# EAGLE design Sphagnum_soc_rev_a (EAGLE 9.6.2)
AUTOR: Renato; CODIGO: 0; DESENHO: Renato; EQUIPAMENTO: Alimentador Caes e Gatos; MODELO: JM01; REV: A
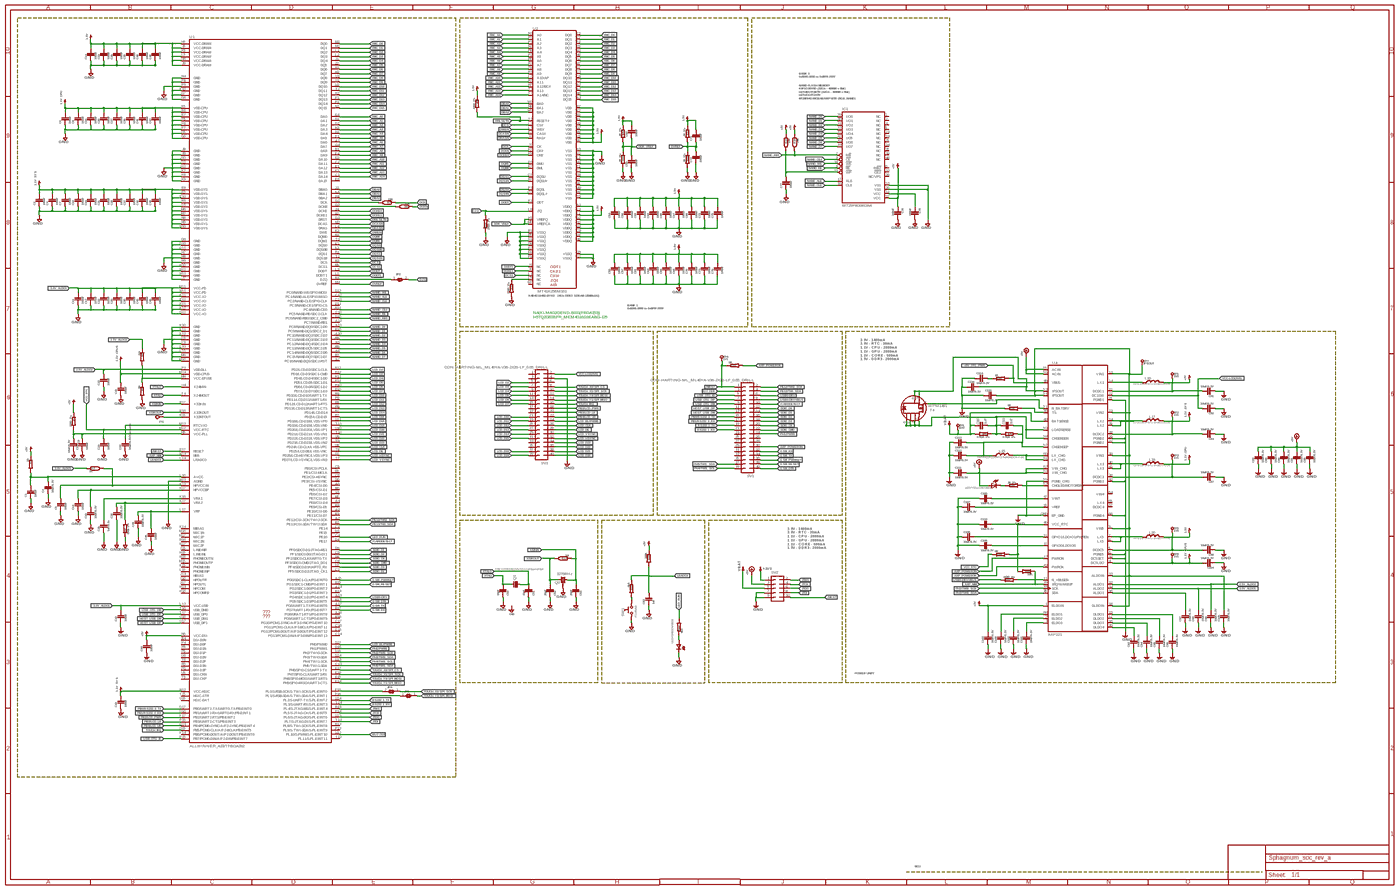
[diagram p0: schematic, sheet 1, overview]
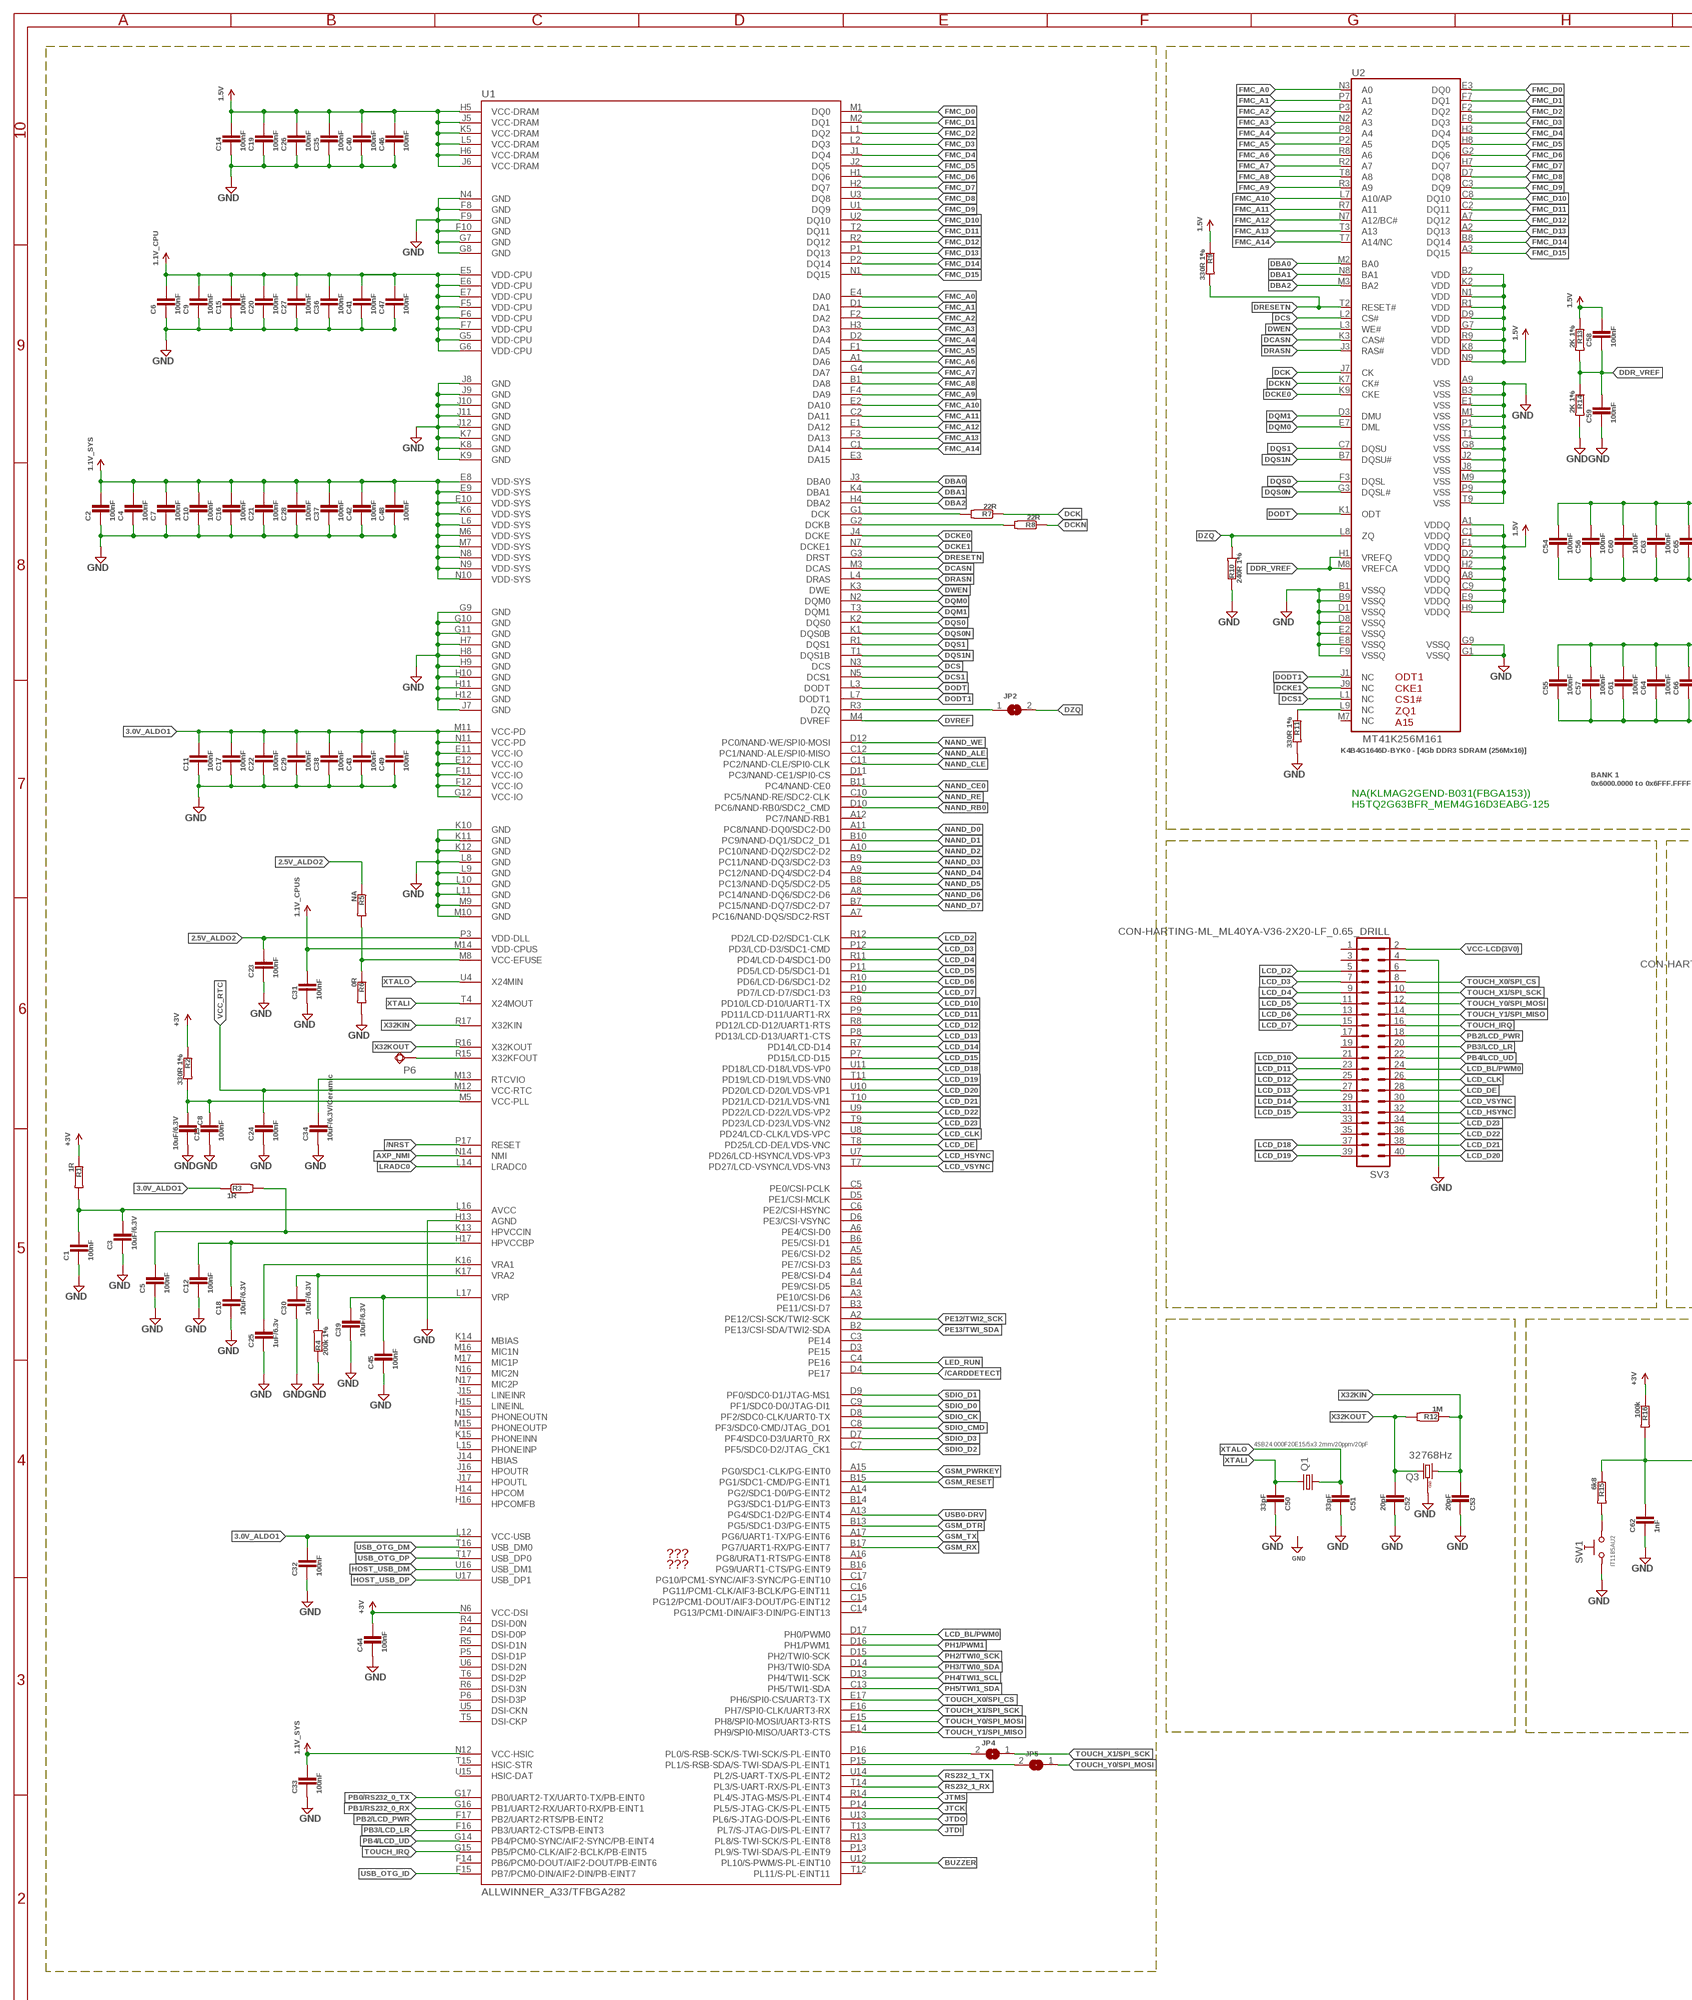
[diagram p1: schematic, sheet 1, part 1 of 4]
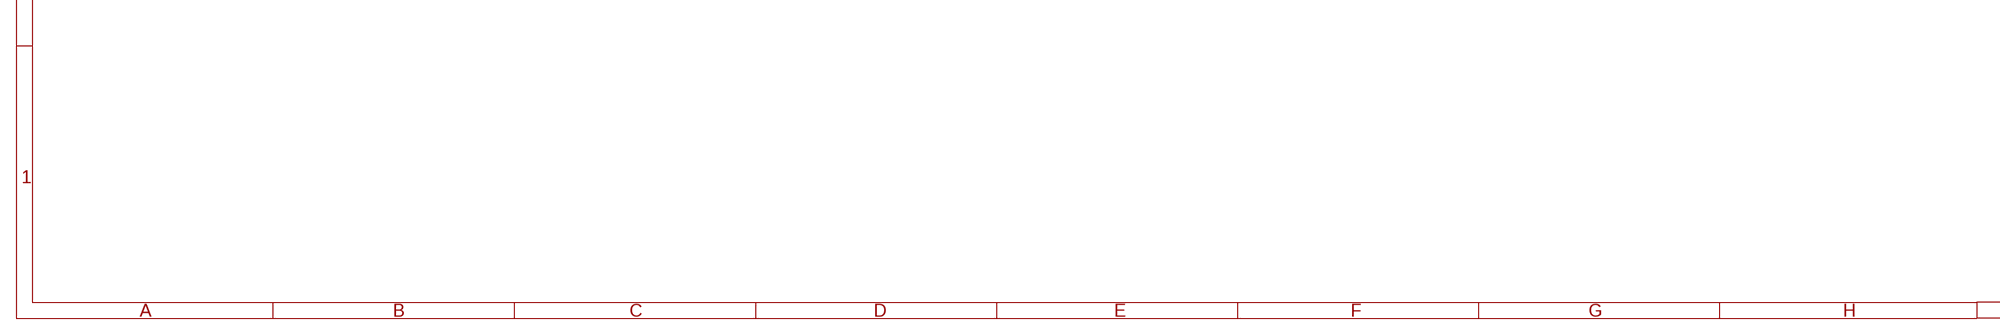
[diagram p2: schematic, sheet 1, part 2 of 4]
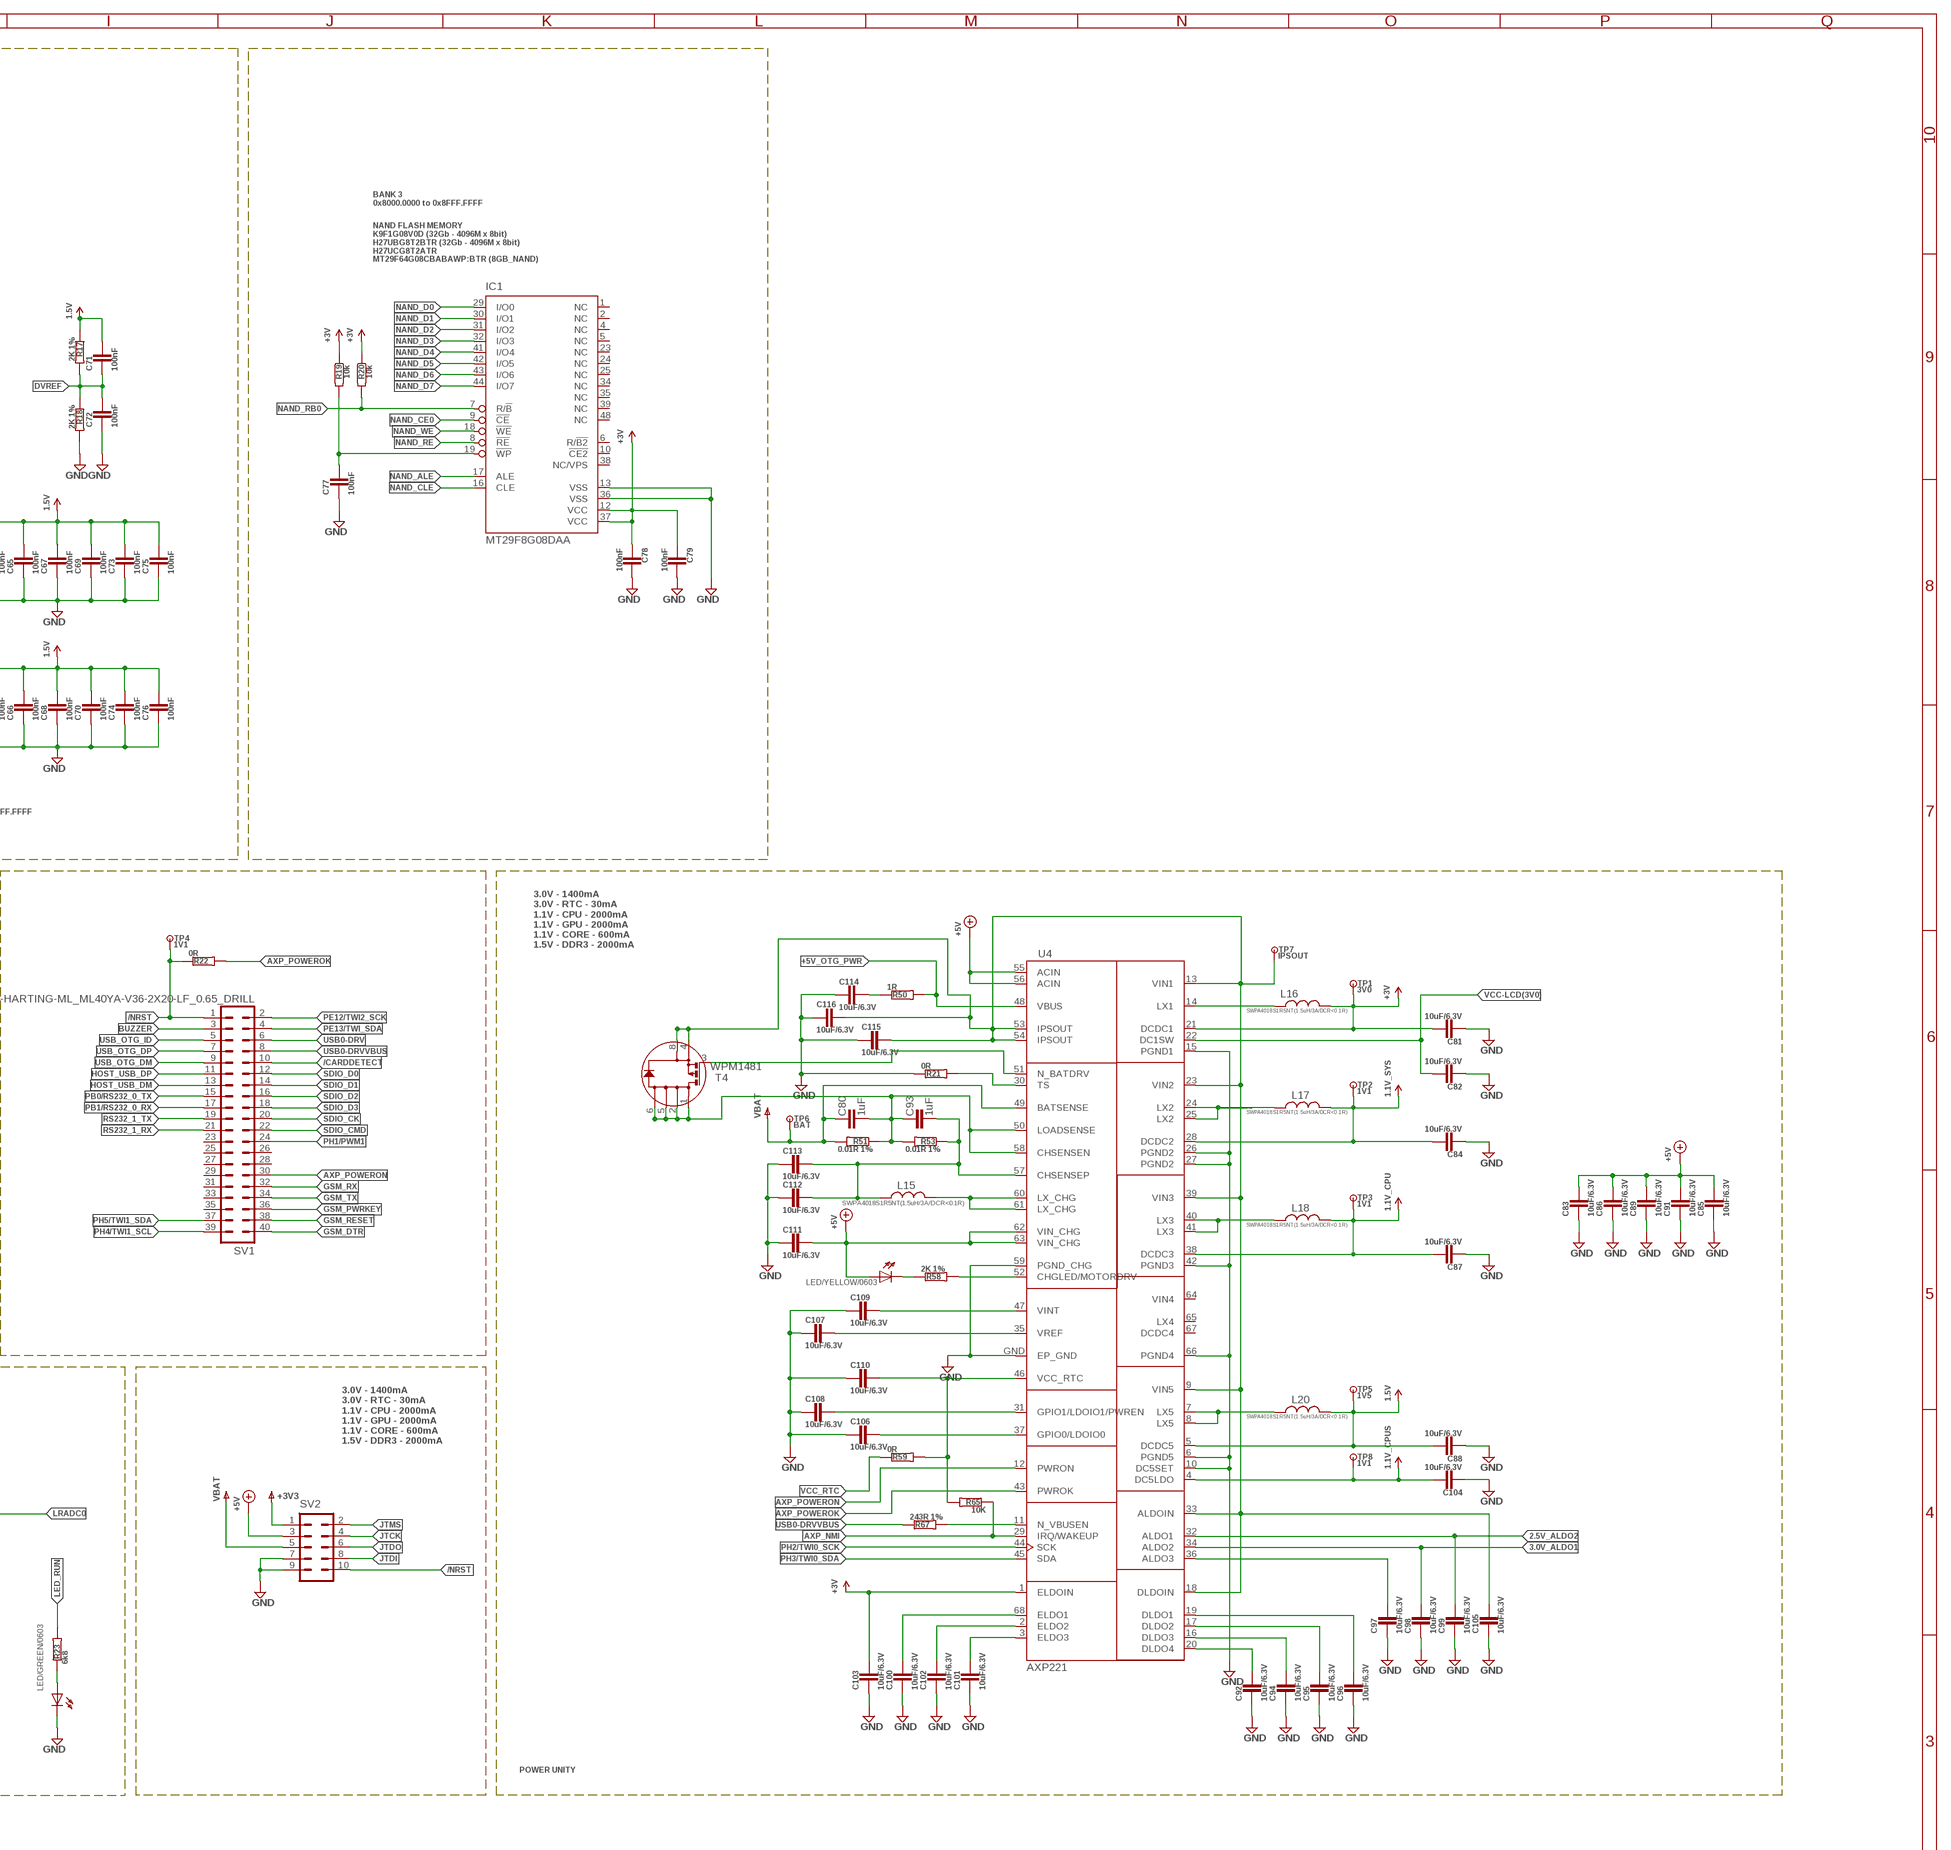
[diagram p3: schematic, sheet 1, part 3 of 4]
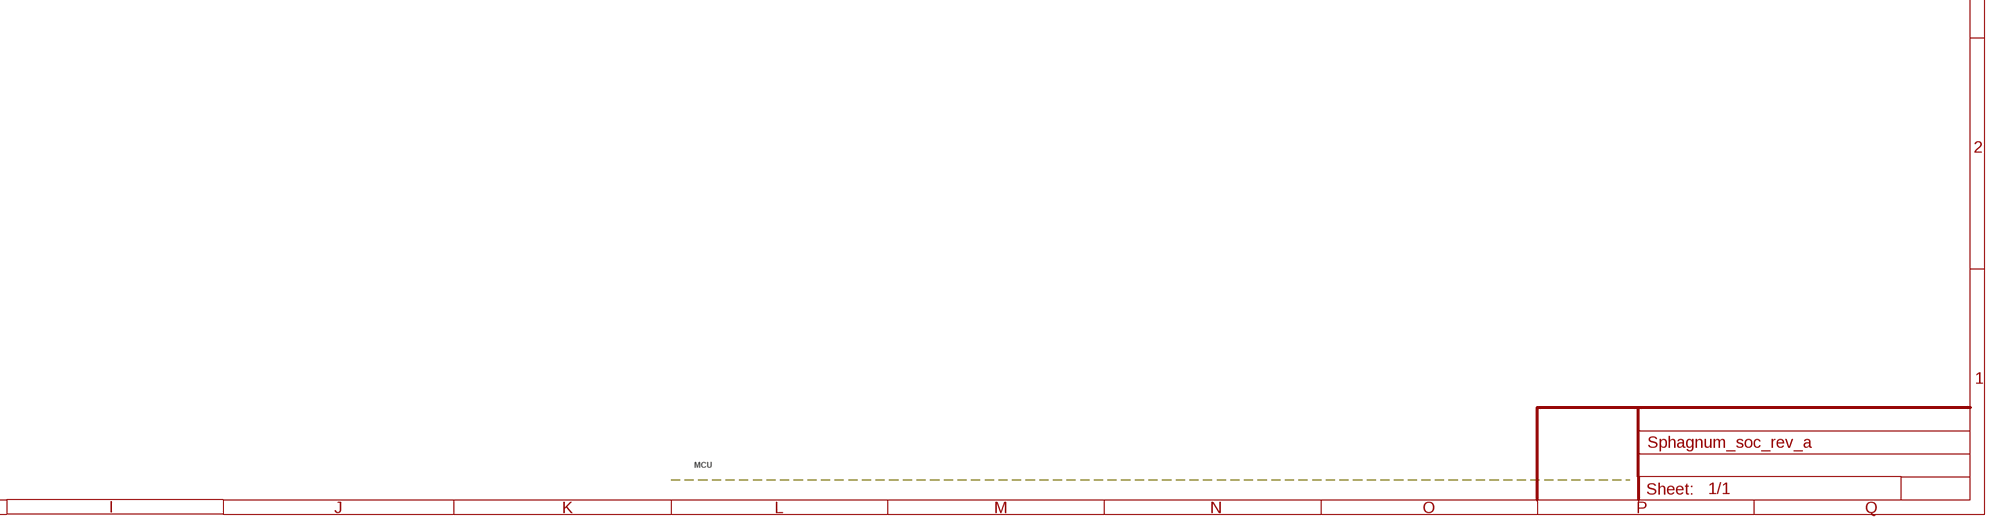
[diagram p4: schematic, sheet 1, part 4 of 4]

## Parts
C1  100nF  C-EUC0603  [C0603]
C2  100nF  C-EUC0603  [C0603]
C3  10uF/6.3V  C-EUC0603  [C0603]
C4  100nF  C-EUC0603  [C0603]
C5  100nF  C-EUC0603  [C0603]
C6  100nF  C-EUC0603  [C0603]
C7  100nF  C-EUC0603  [C0603]
C8  10uF/6.3V  C-EUC0603  [C0603]
C9  100nF  C-EUC0603  [C0603]
C10  100nF  C-EUC0603  [C0603]
C11  100nF  C-EUC0603  [C0603]
C12  100nF  C-EUC0603  [C0603]
C13  100nF  C-EUC0603  [C0603]
C14  100nF  C-EUC0603  [C0603]
C15  100nF  C-EUC0603  [C0603]
C16  100nF  C-EUC0603  [C0603]
C17  100nF  C-EUC0603  [C0603]
C18  10uF/6.3V  C-EUC0603  [C0603]
C19  100nF  C-EUC0603  [C0603]
C20  100nF  C-EUC0603  [C0603]
C21  100nF  C-EUC0603  [C0603]
C22  100nF  C-EUC0603  [C0603]
C23  100nF  C-EUC0603  [C0603]
C24  100nF  C-EUC0603  [C0603]
C25  1uF/6.3v  C-EUC0603  [C0603]
C26  100nF  C-EUC0603  [C0603]
C27  100nF  C-EUC0603  [C0603]
C28  100nF  C-EUC0603  [C0603]
C29  100nF  C-EUC0603  [C0603]
C30  10uF/6.3V  C-EUC0603  [C0603]
C31  100nF  C-EUC0603  [C0603]
C32  100nF  C-EUC0603  [C0603]
C33  100nF  C-EUC0603  [C0603]
C34  10uF/6.3V/Ceramic  C-EUC0603  [C0603]
C35  100nF  C-EUC0603  [C0603]
C36  100nF  C-EUC0603  [C0603]
C37  100nF  C-EUC0603  [C0603]
C38  100nF  C-EUC0603  [C0603]
C39  10uF/6.3V  C-EUC0603  [C0603]
C40  100nF  C-EUC0603  [C0603]
C41  100nF  C-EUC0603  [C0603]
C42  100nF  C-EUC0603  [C0603]
C43  100nF  C-EUC0603  [C0603]
C44  100nF  C-EUC0603  [C0603]
C45  100nF  C-EUC0603  [C0603]
C46  100nF  C-EUC0603  [C0603]
C47  100nF  C-EUC0603  [C0603]
C48  100nF  C-EUC0603  [C0603]
C49  100nF  C-EUC0603  [C0603]
C50  33pF  C-EUC0603  [C0603]
C51  33pF  C-EUC0603  [C0603]
C52  20pF  C-EUC0603  [C0603]
C53  20pF  C-EUC0603  [C0603]
C54  100nF  C-EUC0603  [C0603]
C55  100nF  C-EUC0603  [C0603]
C56  100nF  C-EUC0603  [C0603]
C57  100nF  C-EUC0603  [C0603]
C58  100nF  C-EUC0603  [C0603]
C59  100nF  C-EUC0603  [C0603]
C60  100nF  C-EUC0603  [C0603]
C61  100nF  C-EUC0603  [C0603]
C62  1nF  C-EUC0603  [C0603]
C63  100nF  C-EUC0603  [C0603]
C64  100nF  C-EUC0603  [C0603]
C65  100nF  C-EUC0603  [C0603]
C66  100nF  C-EUC0603  [C0603]
C67  100nF  C-EUC0603  [C0603]
C68  100nF  C-EUC0603  [C0603]
C69  100nF  C-EUC0603  [C0603]
C70  100nF  C-EUC0603  [C0603]
C71  100nF  C-EUC0603  [C0603]
C72  100nF  C-EUC0603  [C0603]
C73  100nF  C-EUC0603  [C0603]
C74  100nF  C-EUC0603  [C0603]
C75  100nF  C-EUC0603  [C0603]
C76  100nF  C-EUC0603  [C0603]
C77  100nF  C-EUC0603  [C0603]
C78  100nF  C-EUC0603  [C0603]
C79  100nF  C-EUC0603  [C0603]
C80  1uF  C-EUC0603  [C0603]
C81  10uF/6.3V  C-EUC0603  [C0603]
C82  10uF/6.3V  C-EUC0603  [C0603]
C83  10uF/6.3V  C-EUC0603  [C0603]
C84  10uF/6.3V  C-EUC0603  [C0603]
C85  10uF/6.3V  C-EUC0603  [C0603]
C86  10uF/6.3V  C-EUC0603  [C0603]
C87  10uF/6.3V  C-EUC0603  [C0603]
C88  10uF/6.3V  C-EUC0603  [C0603]
C89  10uF/6.3V  C-EUC0603  [C0603]
C91  10uF/6.3V  C-EUC0603  [C0603]
C92  10uF/6.3V  C-EUC0603  [C0603]
C93  1uF  C-EUC0603  [C0603]
C94  10uF/6.3V  C-EUC0603  [C0603]
C95  10uF/6.3V  C-EUC0603  [C0603]
C96  10uF/6.3V  C-EUC0603  [C0603]
C97  10uF/6.3V  C-EUC0603  [C0603]
C98  10uF/6.3V  C-EUC0603  [C0603]
C99  10uF/6.3V  C-EUC0603  [C0603]
C100  10uF/6.3V  C-EUC0603  [C0603]
C101  10uF/6.3V  C-EUC0603  [C0603]
C102  10uF/6.3V  C-EUC0603  [C0603]
C103  10uF/6.3V  C-EUC0603  [C0603]
C104  10uF/6.3V  C-EUC0603  [C0603]
C105  10uF/6.3V  C-EUC0603  [C0603]
C106  10uF/6.3V  C-EUC0603  [C0603]
C107  10uF/6.3V  C-EUC0603  [C0603]
C108  10uF/6.3V  C-EUC0603  [C0603]
C109  10uF/6.3V  C-EUC0603  [C0603]
C110  10uF/6.3V  C-EUC0603  [C0603]
C111  10uF/6.3V  C-EUC0603  [C0603]
C112  10uF/6.3V  C-EUC0603  [C0603]
C113  10uF/6.3V  C-EUC0603  [C0603]
C114  10uF/6.3V  C-EUC0603  [C0603]
C115  10uF/6.3V  C-EUC0603  [C0603]
C116  10uF/6.3V  C-EUC0603  [C0603]
CHGLED  LED/YELLOW/0603  LEDLED-0603_TEST  [LED-0603_TEST]
IC1  MT29F8G08DAA  [TSOP48]
JP2  JUMPER-2SMD-NO  [SJ_2S-NO]
JP4  JUMPER_2_NO  [JUMPER_2_NO]
JP5  JUMPER_2_NO  [JUMPER_2_NO]
L15  SWPA4018S1R5NT(1.5uH/3A/DCR<0.1R)  L-SWPA4018S  [SWPA4018S]
L16  SWPA4018S1R5NT(1.5uH/3A/DCR<0.1R)  L-SWPA4018S  [SWPA4018S]
L17  SWPA4018S1R5NT(1.5uH/3A/DCR<0.1R)  L-SWPA4018S  [SWPA4018S]
L18  SWPA4018S1R5NT(1.5uH/3A/DCR<0.1R)  L-SWPA4018S  [SWPA4018S]
L20  SWPA4018S1R5NT(1.5uH/3A/DCR<0.1R)  L-SWPA4018S  [SWPA4018S]
P6  TESTPADTESTPAD_40-ROUND  [TESTPAD_40-ROUND]
Q1  4SB24.000F20E15/5x3.2mm/20ppm/20pF  HC49/S_E4SB25.000F20E15  [HCX-4S]
Q3  32768Hz  Q_GND  [TC26H_3_REPAIR]
R1  1R  R-EU_R0603  [R0603]
R2  330R 1%  R-EU_R0603  [R0603]
R3  1R  R-EU_R0603  [R0603]
R4  200k 1%  R-EU_R0603  [R0603]
R5  NA  R-EU_R0603  [R0603]
R6  0R  R-EU_R0603  [R0603]
R7  22R  R-EU_R0603  [R0603]
R8  22R  R-EU_R0603  [R0603]
R9  330R 1%  R-EU_R0603  [R0603]
R10  240R 1%  R-EU_R0603  [R0603]
R11  330R 1%  R-EU_R0603  [R0603]
R12  1M  R-EU_R0603  [R0603]
R13  2K 1%  R-EU_R0603  [R0603]
R14  2K 1%  R-EU_R0603  [R0603]
R15  6k8  R-EU_R0603  [R0603]
R16  100k  R-EU_R0603  [R0603]
R17  2K 1%  R-EU_R0603  [R0603]
R18  2K 1%  R-EU_R0603  [R0603]
R19  10k  R-EU_R0603  [R0603]
R20  10k  R-EU_R0603  [R0603]
R21  0R  R-EU_R0603  [R0603]
R22  0R  R-EU_R0603  [R0603]
R23  6k8  R-EU_R0603  [R0603]
R50  1R  R-EU_R0603  [R0603]
R51  0.01R 1%  R-EU_R0603  [R0603]
R53  0.01R 1%  R-EU_R0603  [R0603]
R58  2K 1%  R-EU_R0603  [R0603]
R59  0R  R-EU_R0603  [R0603]
R65  10K  R-EU_R0603  [R0603]
R67  243R 1%  R-EU_R0603  [R0603]
RUN  LED/GREEN/0603  LEDLED-0603_TEST  [LED-0603_TEST]
SV1  CON-HARTING-ML_ML40YA-V36-2X20-LF_0.65_DRILL  [CON-HARTING-ML_YA-V36P-2X20-LF_0.65_DRILL]
SV2  CON-HARTING-ML_ML10YA-V36P-2X5-LF_0.60_DRILL  [CON-HARTING-ML_YA-V36P-2X5-LF_0.60_DRILL]
SV3  CON-HARTING-ML_ML40YA-V36-2X20-LF_0.65_DRILL  [CON-HARTING-ML_YA-V36P-2X20-LF_0.65_DRILL]
SW1  IT1185AU2  SW-TAKTIT1185AU2  [IT1185AU2]
T4  WPM1481  [DFN2*2-6L]
TP1  3V0  TEST-POINT3  [PAD.03X.03]
TP2  1V1  TEST-POINT3  [PAD.03X.03]
TP3  1V1  TEST-POINT3  [PAD.03X.03]
TP4  1V1  TEST-POINT3  [PAD.03X.03]
TP5  1V5  TEST-POINT3  [PAD.03X.03]
TP6  BAT  TEST-POINT3  [PAD.03X.03]
TP7  IPSOUT  TEST-POINT3  [PAD.03X.03]
TP8  1V1  TEST-POINT3  [PAD.03X.03]
U1  ALLWINNER_A33/TFBGA282  [TFBGA282]
U2  MT41K256M161  [FBGA_96BALL]
U4  AXP221  [OLIMEX_IC_QFN68-8X8-04]

## Nets
1.1V_CPU [pwr]: C6.1 C9.1 C15.1 C20.1 C27.1 C36.1 C41.1 C47.1 C87.1 L18.1 TP3.P$1 U1.E5(VDD-CPU) U1.E6(VDD-CPU) U1.E7(VDD-CPU) U1.F5(VDD-CPU) U1.F6(VDD-CPU) U1.F7(VDD-CPU) U1.G5(VDD-CPU) U1.G6(VDD-CPU) U4.38(DCDC3)
1.1V_CPUS: C31.1 C104.1 TP8.P$1 U1.M14(VDD-CPUS) U4.4(DC5LDO)
1.1V_SYS [pwr]: C2.1 C4.1 C7.1 C10.1 C16.1 C21.1 C28.1 C33.1 C37.1 C42.1 C48.1 C84.1 L17.1 TP2.P$1 U1.E8(VDD-SYS) U1.E9(VDD-SYS) U1.E10(VDD-SYS) U1.K6(VDD-SYS) U1.L6(VDD-SYS) U1.M6(VDD-SYS) U1.M7(VDD-SYS) U1.N8(VDD-SYS) U1.N9(VDD-SYS) U1.N10(VDD-SYS) U1.N12(VCC-HSIC) U4.28(DCDC2)
1.5V [pwr]: C14.1 C19.1 C26.1 C35.1 C40.1 C46.1 C54.1 C55.1 C56.1 C57.1 C58.1 C60.1 C61.1 C63.1 C64.1 C65.1 C66.1 C67.1 C68.1 C69.1 C70.1 C71.1 C73.1 C74.1 C75.1 C76.1 C88.1 L20.1 R9.1 R13.1 R17.1 TP5.P$1 U1.H5(VCC-DRAM) U1.H6(VCC-DRAM) U1.J5(VCC-DRAM) U1.J6(VCC-DRAM) U1.K5(VCC-DRAM) U1.L5(VCC-DRAM) U2.A1(VDDQ) U2.A8(VDDQ) U2.B2(VDD) U2.C1(VDDQ) U2.C9(VDDQ) U2.D2(VDDQ) U2.D9(VDD) U2.E9(VDDQ) U2.F1(VDDQ) U2.G7(VDD) U2.H2(VDDQ) U2.H9(VDDQ) U2.K2(VDD) U2.K8(VDD) U2.N1(VDD) U2.N9(VDD) U2.R1(VDD) U2.R9(VDD) U4.5(DCDC5)
2.5V_ALDO2: C23.1 C99.1 R5.1 U1.P3(VDD-DLL) U4.32(ALDO1)
3.0V_ALDO1: C11.1 C17.1 C22.1 C29.1 C32.1 C38.1 C43.1 C49.1 C98.1 R3.1 U1.E11(VCC-IO) U1.E12(VCC-IO) U1.F11(VCC-IO) U1.F12(VCC-IO) U1.G12(VCC-IO) U1.L12(VCC-USB) U1.M11(VCC-PD) U1.N11(VCC-PD) U4.34(ALDO2)
+3V [pwr]: C44.1 C78.2 C79.2 C81.1 C103.1 IC1.12(VCC) IC1.37(VCC) L16.1 R1.1 R2.1 R16.1 R19.1 R20.1 TP1.P$1 U1.N6(VCC-DSI) U4.1(ELDOIN) U4.21(DCDC1)
+3V3 [pwr]: C80.2 R51.2 SV2.1 SV2.5 TP6.P$1 U4.49(BATSENSE) ; supply symbol labelled VBAT
+5V [pwr]: C83.1 C85.1 C86.1 C89.1 C91.1 C111.1 CHGLED.A SV2.3 U4.55(ACIN) U4.56(ACIN) U4.62(VIN_CHG) U4.63(VIN_CHG)
+5V_OTG_PWR: R50.2 U4.48(VBUS)
/CARDDETECT: SV1.10 U1.D4(PE17)
/NRST: R22.1 SV1.1 SV2.10 TP4.P$1 U1.P17(RESET)
AXP_NMI: R65.1 U1.N14(NMI) U4.29(IRQ/WAKEUP)
AXP_POWEROK: R22.2 U4.43(PWROK)
AXP_POWERON: SV1.30 U4.12(PWRON)
BUZZER: SV1.3 U1.U12(PL10/S-PWM/S-PL-EINT10)
DBA0 [memory]: U1.J3(DBA0) U2.M2(BA0)
DBA1 [memory]: U1.K4(DBA1) U2.N8(BA1)
DBA2 [memory]: U1.H4(DBA2) U2.M3(BA2)
DCASN [memory]: U1.M3(DCAS) U2.K3(CAS#)
DCK [memory]: R7.1 U2.J7(CK)
DCKE0 [memory]: U1.J4(DCKE) U2.K9(CKE)
DCKE1 [memory]: U1.N7(DCKE1) U2.J9(NC)
DCKN [memory]: R8.1 U2.K7(CK#)
DCS [memory]: U1.N3(DCS) U2.L2(CS#)
DCS1 [memory]: U1.N5(DCS1) U2.L1(NC)
DDR_VREF [memory]: C58.2 C59.1 R13.2 R14.1 U2.H1(VREFQ) U2.M8(VREFCA)
DODT [memory]: U1.L3(DODT) U2.K1(ODT)
DODT1 [memory]: U1.L7(DODT1) U2.J1(NC)
DQM0 [memory]: U1.N2(DQM0) U2.E7(DML)
DQM1 [memory]: U1.T3(DQM1) U2.D3(DMU)
DQS0 [memory]: U1.K2(DQS0) U2.F3(DQSL)
DQS0N [memory]: U1.K1(DQS0B) U2.G3(DQSL#)
DQS1 [memory]: U1.R1(DQS1) U2.C7(DQSU)
DQS1N [memory]: U1.T1(DQS1B) U2.B7(DQSU#)
DRASN [memory]: U1.L4(DRAS) U2.J3(RAS#)
DRESETN [memory]: R9.2 U1.G3(DRST) U2.T2(RESET#)
DVREF [memory]: C71.2 C72.1 R17.2 R18.1 U1.M4(DVREF)
DWEN [memory]: U1.K3(DWE) U2.L3(WE#)
DZQ [memory]: JP2.2 R10.2 U2.L8(ZQ)
FMC_A0 [memory]: U1.E4(DA0) U2.N3(A0)
FMC_A1 [memory]: U1.D1(DA1) U2.P7(A1)
FMC_A2 [memory]: U1.F2(DA2) U2.P3(A2)
FMC_A3 [memory]: U1.H3(DA3) U2.N2(A3)
FMC_A4 [memory]: U1.D2(DA4) U2.P8(A4)
FMC_A5 [memory]: U1.F1(DA5) U2.P2(A5)
FMC_A6 [memory]: U1.A1(DA6) U2.R8(A6)
FMC_A7 [memory]: U1.G4(DA7) U2.R2(A7)
FMC_A8 [memory]: U1.B1(DA8) U2.T8(A8)
FMC_A9 [memory]: U1.F4(DA9) U2.R3(A9)
FMC_A10 [memory]: U1.E2(DA10) U2.L7(A10/AP)
FMC_A11 [memory]: U1.C2(DA11) U2.R7(A11)
FMC_A12 [memory]: U1.E1(DA12) U2.N7(A12/BC#)
FMC_A13 [memory]: U1.F3(DA13) U2.T3(A13)
FMC_A14 [memory]: U1.C1(DA14) U2.T7(A14/NC)
FMC_D0 [memory]: U1.M1(DQ0) U2.E3(DQ0)
FMC_D1 [memory]: U1.M2(DQ1) U2.F7(DQ1)
FMC_D2 [memory]: U1.L1(DQ2) U2.F2(DQ2)
FMC_D3 [memory]: U1.L2(DQ3) U2.F8(DQ3)
FMC_D4 [memory]: U1.J1(DQ4) U2.H3(DQ4)
FMC_D5 [memory]: U1.J2(DQ5) U2.H8(DQ5)
FMC_D6 [memory]: U1.H1(DQ6) U2.G2(DQ6)
FMC_D7 [memory]: U1.H2(DQ7) U2.H7(DQ7)
FMC_D8 [memory]: U1.U3(DQ8) U2.D7(DQ8)
FMC_D9 [memory]: U1.U1(DQ9) U2.C3(DQ9)
FMC_D10 [memory]: U1.U2(DQ10) U2.C8(DQ10)
FMC_D11 [memory]: U1.T2(DQ11) U2.C2(DQ11)
FMC_D12 [memory]: U1.R2(DQ12) U2.A7(DQ12)
FMC_D13 [memory]: U1.P1(DQ13) U2.A2(DQ13)
FMC_D14 [memory]: U1.P2(DQ14) U2.B8(DQ14)
FMC_D15 [memory]: U1.N1(DQ15) U2.A3(DQ15)
GND: C1.2 C2.2 C3.2 C4.2 C5.2 C6.2 C7.2 C8.1 C9.2 C10.2 C11.2 C12.2 C13.2 C14.2 C15.2 C16.2 C17.2 C18.2 C19.2 C20.2 C21.2 C22.2 C23.2 C24.2 C25.2 C26.2 C27.2 C28.2 C29.2 C30.2 C31.2 C32.2 C33.2 C34.2 C35.2 C36.2 C37.2 C38.2 C39.2 C40.2 C41.2 C42.2 C43.2 C44.2 C45.2 C46.2 C47.2 C48.2 C49.2 C50.2 C51.2 C52.2 C53.2 C54.2 C55.2 C56.2 C57.2 C59.2 C60.2 C61.2 C62.2 C63.2 C64.2 C65.2 C66.2 C67.2 C68.2 C69.2 C70.2 C72.2 C73.2 C74.2 C75.2 C76.2 C77.2 C78.1 C79.1 C81.2 C82.2 C83.2 C84.2 C85.2 C86.2 C87.2 C88.2 C89.2 C91.2 C92.2 C94.2 C95.2 C96.2 C97.2 C98.2 C99.2 C100.2 C101.2 C102.2 C103.2 C104.2 C105.2 C106.2 C107.2 C108.2 C109.2 C110.2 C111.2 C112.2 C113.2 C114.2 C115.2 C116.2 IC1.13(VSS) IC1.36(VSS) Q3.GND R4.1 R6.2 R10.1 R11.2 R14.2 R18.2 R21.1 RUN.C SV2.7 SV2.9 SV3.4 SW1.1 U1.F8(GND) U1.F9(GND) U1.F10(GND) U1.G7(GND) U1.G8(GND) U1.G9(GND) U1.G10(GND) U1.G11(GND) U1.H7(GND) U1.H8(GND) U1.H9(GND) U1.H10(GND) U1.H11(GND) U1.H12(GND) U1.H13(AGND) U1.J7(GND) U1.J8(GND) U1.J9(GND) U1.J10(GND) U1.J11(GND) U1.J12(GND) U1.K7(GND) U1.K8(GND) U1.K9(GND) U1.K10(GND) U1.K11(GND) U1.K12(GND) U1.L8(GND) U1.L9(GND) U1.L10(GND) U1.L11(GND) U1.M9(GND) U1.M10(GND) U1.N4(GND) U2.A9(VSS) U2.B1(VSSQ) U2.B3(VSS) U2.B9(VSSQ) U2.D1(VSSQ) U2.D8(VSSQ) U2.E1(VSS) U2.E2(VSSQ) U2.E8(VSSQ) U2.F9(VSSQ) U2.G1(VSSQ) U2.G8(VSS) U2.G9(VSSQ) U2.J2(VSS) U2.J8(VSS) U2.M1(VSS) U2.M9(VSS) U2.P1(VSS) U2.P9(VSS) U2.T1(VSS) U2.T9(VSS) U4.6(PGND5) U4.10(DC5SET) U4.15(PGND1) U4.26(PGND2) U4.27(PGND2) U4.42(PGND3) U4.59(PGND_CHG) U4.66(PGND4) U4.GND(EP_GND)
GSM_DTR: SV1.40 U1.B13(PG5/SDC1-D3/PG-EINT5)
GSM_PWRKEY: SV1.36 U1.A15(PG0/SDC1-CLK/PG-EINT0)
GSM_RESET: SV1.38 U1.B15(PG1/SDC1-CMD/PG-EINT1)
GSM_RX: SV1.32 U1.B17(PG7/UART1-RX/PG-EINT7)
GSM_TX: SV1.34 U1.A17(PG6/UART1-TX/PG-EINT6)
HOST_USB_DM: SV1.13 U1.U16(USB_DM1)
HOST_USB_DP: SV1.11 U1.U17(USB_DP1)
HPVCCIN: C5.1 R3.2 U1.K13(HPVCCIN)
JTCK: SV2.4 U1.P14(PL5/S-JTAG-CK/S-PL-EINT5)
JTDI: SV2.8 U1.T13(PL7/S-JTAG-DI/S-PL-EINT7)
JTDO: SV2.6 U1.U13(PL6/S-JTAG-DO/S-PL-EINT6)
JTMS: SV2.2 U1.R14(PL4/S-JTAG-MS/S-PL-EINT4)
LCD_BL/PWM0 [lcd]: SV3.24 U1.D17(PH0/PWM0)
LCD_CLK [lcd]: SV3.26 U1.U8(PD24/LCD-CLK/LVDS-VPC)
LCD_D2 [lcd]: SV3.5 U1.R12(PD2/LCD-D2/SDC1-CLK)
LCD_D3 [lcd]: SV3.7 U1.P12(PD3/LCD-D3/SDC1-CMD)
LCD_D4 [lcd]: SV3.9 U1.R11(PD4/LCD-D4/SDC1-D0)
LCD_D5 [lcd]: SV3.11 U1.P11(PD5/LCD-D5/SDC1-D1)
LCD_D6 [lcd]: SV3.13 U1.R10(PD6/LCD-D6/SDC1-D2)
LCD_D7 [lcd]: SV3.15 U1.P10(PD7/LCD-D7/SDC1-D3)
LCD_D10 [lcd]: SV3.21 U1.R9(PD10/LCD-D10/UART1-TX)
LCD_D11 [lcd]: SV3.23 U1.P9(PD11/LCD-D11/UART1-RX)
LCD_D12 [lcd]: SV3.25 U1.R8(PD12/LCD-D12/UART1-RTS)
LCD_D13 [lcd]: SV3.27 U1.P8(PD13/LCD-D13/UART1-CTS)
LCD_D14 [lcd]: SV3.29 U1.R7(PD14/LCD-D14)
LCD_D15 [lcd]: SV3.31 U1.P7(PD15/LCD-D15)
LCD_D18 [lcd]: SV3.37 U1.U11(PD18/LCD-D18/LVDS-VP0)
LCD_D19 [lcd]: SV3.39 U1.T11(PD19/LCD-D19/LVDS-VN0)
LCD_D20 [lcd]: SV3.40 U1.U10(PD20/LCD-D20/LVDS-VP1)
LCD_D21 [lcd]: SV3.38 U1.T10(PD21/LCD-D21/LVDS-VN1)
LCD_D22 [lcd]: SV3.36 U1.U9(PD22/LCD-D22/LVDS-VP2)
LCD_D23 [lcd]: SV3.34 U1.T9(PD23/LCD-D23/LVDS-VN2)
LCD_DE [lcd]: SV3.28 U1.T8(PD25/LCD-DE/LVDS-VNC)
LCD_HSYNC [lcd]: SV3.32 U1.U7(PD26/LCD-HSYNC/LVDS-VP3)
LCD_VSYNC [lcd]: SV3.30 U1.T7(PD27/LCD-VSYNC/LVDS-VN3)
LED_RUN: R23.2 U1.C4(PE16)
LRADC0: C62.1 R15.1 R16.2 U1.L14(LRADC0)
N$1: JP2.1 U1.R3(DZQ)
N$2 [pwr]: R5.2 R6.1 U1.M8(VCC-EFUSE)
N$3: JP5.2 U1.P15(PL1/S-RSB-SDA/S-TWI-SDA/S-PL-EINT1)
N$4: R11.1 U2.L9(NC)
N$5: C77.1 IC1.19(!WP) R19.2
N$6: C34.1 U1.M13(RTCVIO)
N$7: JP4.2 U1.P16(PL0/S-RSB-SCK/S-TWI-SCK/S-PL-EINT0)
N$8: C8.2 C13.1 R2.2 U1.M5(VCC-PLL)
N$9: T4.3(G) U4.51(N_BATDRV)
N$10: C80.1 C93.2 R51.1 R53.2 T4.1(D) T4.2(D1) T4.5(D2) T4.6(D3) T4.7(D4) U4.50(LOADSENSE) U4.58(CHSENSEN)
N$11: R7.2 U1.G1(DCK)
N$12: R8.2 U1.G2(DCKB)
N$13: R23.1 RUN.A
N$14: C105.1 C115.1 C116.1 T4.4(S) T4.8(S1) TP7.P$1 U4.9(VIN5) U4.13(VIN1) U4.18(DLDOIN) U4.23(VIN2) U4.33(ALDOIN) U4.39(VIN3) U4.53(IPSOUT) U4.54(IPSOUT)
N$19: C12.1 C18.1 U1.H17(HPVCCBP)
N$28: C25.1 U1.K16(VRA1)
N$31 [pwr]: C1.1 C3.1 R1.2 U1.L16(AVCC)
N$39: R15.2 SW1.2
N$52: P6.1(PP) U1.R15(X32KFOUT)
N$66: L15.1 U4.60(LX_CHG) U4.61(LX_CHG)
N$67: CHGLED.C R58.1
N$71: C93.1 C112.1 C113.1 L15.2 R53.1 U4.57(CHSENSEP)
N$73: C106.1 U4.37(GPIO0/LDOIO0)
N$74: C108.1 U4.31(GPIO1/LDOIO1/PWREN)
N$75: C92.1 U4.20(DLDO4)
N$76: C94.1 U4.16(DLDO3)
N$79: L16.2 U4.14(LX1)
N$80: L17.2 U4.24(LX2) U4.25(LX2)
N$82: L18.2 U4.40(LX3) U4.41(LX3)
N$86: L20.2 U4.7(LX5) U4.8(LX5)
N$87: R67.2 U4.11(N_VBUSEN)
N$88 [pwr]: R21.2 U4.30(TS)
N$89: C95.1 U4.17(DLDO2)
N$93: C96.1 U4.19(DLDO1)
N$95: C97.1 U4.36(ALDO3)
N$96: C101.1 U4.3(ELDO3)
N$97: C102.1 U4.2(ELDO2)
N$98: C100.1 U4.68(ELDO1)
N$105: C110.1 R59.2 R65.2 U4.46(VCC_RTC)
N$107: C107.1 U4.35(VREF)
N$108: C109.1 U4.47(VINT)
N$109: R58.2 U4.52(CHGLED/MOTORDRV)
N$122: C39.1 C45.1 U1.L17(VRP)
N$135: C114.1 R50.1
N$176: C30.1 R4.2 U1.K17(VRA2)
NAND_ALE [memory]: IC1.17(ALE) U1.C12(PC1/NAND-ALE/SPI0-MISO)
NAND_CE0 [memory]: IC1.9(!CE) U1.B11(PC4/NAND-CE0)
NAND_CLE [memory]: IC1.16(CLE) U1.C11(PC2/NAND-CLE/SPI0-CLK)
NAND_D0 [memory]: IC1.29(I/O0) U1.A11(PC8/NAND-DQ0/SDC2-D0)
NAND_D1 [memory]: IC1.30(I/O1) U1.B10(PC9/NAND-DQ1/SDC2_D1)
NAND_D2 [memory]: IC1.31(I/O2) U1.A10(PC10/NAND-DQ2/SDC2-D2)
NAND_D3 [memory]: IC1.32(I/O3) U1.B9(PC11/NAND-DQ3/SDC2-D3)
NAND_D4 [memory]: IC1.41(I/O4) U1.A9(PC12/NAND-DQ4/SDC2-D4)
NAND_D5 [memory]: IC1.42(I/O5) U1.B8(PC13/NAND-DQ5/SDC2-D5)
NAND_D6 [memory]: IC1.43(I/O6) U1.A8(PC14/NAND-DQ6/SDC2-D6)
NAND_D7 [memory]: IC1.44(I/O7) U1.B7(PC15/NAND-DQ7/SDC2-D7)
NAND_RB0 [memory]: IC1.7(R/!B) R20.2 U1.D10(PC6/NAND-RB0/SDC2_CMD)
NAND_RE [memory]: IC1.8(!RE) U1.C10(PC5/NAND-RE/SDC2-CLK)
NAND_WE [memory]: IC1.18(!WE) U1.D12(PC0/NAND-WE/SPI0-MOSI)
PB0/RS232_0_TX: SV1.15 U1.G17(PB0/UART2-TX/UART0-TX/PB-EINT0)
PB1/RS232_0_RX: SV1.17 U1.G16(PB1/UART2-RX/UART0-RX/PB-EINT1)
PB2/LCD_PWR [lcd]: SV3.18 U1.F17(PB2/UART2-RTS/PB-EINT2)
PB3/LCD_LR [lcd]: SV3.20 U1.F16(PB3/UART2-CTS/PB-EINT3)
PB4/LCD_UD [lcd]: SV3.22 U1.G14(PB4/PCM0-SYNC/AIF2-SYNC/PB-EINT4)
PE12/TWI2_SCK: SV1.2 U1.A2(PE12/CSI-SCK/TWI2-SCK)
PE13/TWI_SDA: SV1.4 U1.B2(PE13/CSI-SDA/TWI2-SDA)
PH1/PWM1: SV1.24 U1.D16(PH1/PWM1)
PH2/TWI0_SCK: U1.D15(PH2/TWI0-SCK) U4.44(SCK)
PH3/TWI0_SDA: U1.D14(PH3/TWI0-SDA) U4.45(SDA)
PH4/TWI1_SCL: SV1.39 U1.D13(PH4/TWI1-SCK)
PH5/TWI1_SDA: SV1.37 U1.C13(PH5/TWI1-SDA)
RS232_1_RX: SV1.21 U1.T14(PL3/S-UART-RX/S-PL-EINT3)
RS232_1_TX: SV1.19 U1.U14(PL2/S-UART-TX/S-PL-EINT2)
SDIO_CK: SV1.20 U1.D8(PF2/SDC0-CLK/UART0-TX)
SDIO_CMD: SV1.22 U1.C8(PF3/SDC0-CMD/JTAG_DO1)
SDIO_D0: SV1.12 U1.C9(PF1/SDC0-D0/JTAG-DI1)
SDIO_D1: SV1.14 U1.D9(PF0/SDC0-D1/JTAG-MS1)
SDIO_D2: SV1.16 U1.C7(PF5/SDC0-D2/JTAG_CK1)
SDIO_D3: SV1.18 U1.D7(PF4/SDC0-D3/UART0_RX)
TOUCH_IRQ [lcd]: SV3.16 U1.G15(PB5/PCM0-CLK/AIF2-BCLK/PB-EINT5)
TOUCH_X0/SPI_CS [lcd]: SV3.8 U1.E17(PH6/SPI0-CS/UART3-TX)
TOUCH_X1/SPI_SCK [lcd]: JP4.1 SV3.10 U1.E16(PH7/SPI0-CLK/UART3-RX)
TOUCH_Y0/SPI_MOSI [lcd]: JP5.1 SV3.12 U1.E15(PH8/SPI0-MOSI/UART3-RTS)
TOUCH_Y1/SPI_MISO [lcd]: SV3.14 U1.E14(PH9/SPI0-MISO/UART3-CTS)
USB0-DRV: SV1.6 U1.A13(PG4/SDC1-D2/PG-EINT4)
USB0-DRVVBUS: R67.1 SV1.8
USB_OTG_DM: SV1.9 U1.T16(USB_DM0)
USB_OTG_DP: SV1.7 U1.T17(USB_DP0)
USB_OTG_ID: SV1.5 U1.F15(PB7/PCM0-DIN/AIF2-DIN/PB-EINT7)
VCC-LCD(3V0): C82.1 SV3.2 U4.22(DC1SW)
VCC_RTC: C24.1 R59.1 U1.M12(VCC-RTC)
X32KIN: C53.1 Q3.1 R12.1 U1.R17(X32KIN)
X32KOUT: C52.1 Q3.2 R12.2 U1.R16(X32KOUT)
XTALI: C50.1 Q1.2 U1.T4(X24MOUT)
XTALO: C51.1 Q1.1 U1.U4(X24MIN)
Unconnected: IC1.1(NC) IC1.2(NC) IC1.4(NC) IC1.5(NC) IC1.6(R/!B2) IC1.10(!CE2) IC1.23(NC) IC1.24(NC) IC1.25(NC) IC1.34(NC) IC1.35(NC) IC1.38(NC/VPS) IC1.39(NC) IC1.48(NC) SV1.23 SV1.25 SV1.26 SV1.27 SV1.28 SV1.29 SV1.31 SV1.33 SV1.35 SV3.1 SV3.3 SV3.6 SV3.17 SV3.19 SV3.33 SV3.35 U1.A3(PE10/CSI-D6) U1.A4(PE8/CSI-D4) U1.A5(PE6/CSI-D2) U1.A6(PE4/CSI-D0) U1.A7(PC16/NAND-DQS/SDC2-RST) U1.A12(PC7/NAND-RB1) U1.A14(PG2/SDC1-D0/PG-EINT2) U1.A16(PG8/URAT1-RTS/PG-EINT8) U1.B3(PE11/CSI-D7) U1.B4(PE9/CSI-D5) U1.B5(PE7/CSI-D3) U1.B6(PE5/CSI-D1) U1.B14(PG3/SDC1-D1/PG-EINT3) U1.B16(PG9/UART1-CTS/PG-EINT9) U1.C3(PE14) U1.C5(PE0/CSI-PCLK) U1.C6(PE2/CSI-HSYNC) U1.C14(PG13/PCM1-DIN/AIF3-DIN/PG-EINT13) U1.C15(PG12/PCM1-DOUT/AIF3-DOUT/PG-EINT12) U1.C16(PG11/PCM1-CLK/AIF3-BCLK/PG-EINT11) U1.C17(PG10/PCM1-SYNC/AIF3-SYNC/PG-EINT10) U1.D3(PE15) U1.D5(PE1/CSI-MCLK) U1.D6(PE3/CSI-VSYNC) U1.D11(PC3/NAND-CE1/SPI0-CS) U1.E3(DA15) U1.F14(PB6/PCM0-DOUT/AIF2-DOUT/PB-EINT6) U1.H14(HPCOM) U1.H15(LINEINL) U1.H16(HPCOMFB) U1.J14(HBIAS) U1.J15(LINEINR) U1.J16(HPOUTR) U1.J17(HPOUTL) U1.K14(MBIAS) U1.K15(PHONEINN) U1.L15(PHONEINP) U1.M15(PHONEOUTP) U1.M16(MIC1N) U1.M17(MIC1P) U1.N15(PHONEOUTN) U1.N16(MIC2N) U1.N17(MIC2P) U1.P4(DSI-D0P) U1.P5(DSI-D1P) U1.P6(DSI-D3P) U1.P13(PL9/S-TWI-SDA/S-PL-EINT9) U1.R4(DSI-D0N) U1.R5(DSI-D1N) U1.R6(DSI-D3N) U1.R13(PL8/S-TWI-SCK/S-PL-EINT8) U1.T5(DSI-CKP) U1.T6(DSI-D2P) U1.T12(PL11/S-PL-EINT11) U1.T15(HSIC-STR) U1.U5(DSI-CKN) U1.U6(DSI-D2N) U1.U15(HSIC-DAT) U2.M7(NC) U4.64(VIN4) U4.65(LX4) U4.67(DCDC4)

## Notes on the sheet
- BANK 3
  0x8000.0000 to 0x8FFF.FFFF
- NAND FLASH MEMORY 
  K9F1G08V0D (32Gb - 4096M x 8bit)
  H27UBG8T2BTR (32Gb - 4096M x 8bit)
  H27UCG8T2ATR
  MT29F64G08CBABAWP:BTR (8GB_NAND)
- 5.0V | GND
- 3.3V | GND
- R0 | R1
- R2 | R3
- R4 | R5
- R6 | R7
- G0 | G1
- G2 | G3
- G4 | G5
- G6 | G7
- B0 | B1
- B2 | B3
- B4 | B5
- B6 | B7
- HSYNC | VSYNC
- CLK | DE
- K4B4G1646D-BYK0 - [4Gb DDR3 SDRAM (256Mx16)]
- L/R | U/D
- PWRE | BKL
- INT/X1 | RES/X2
- BANK 1
  0x6000.0000 to 0x6FFF.FFFF
- SCL/Y1 | SDA/Y2
- NA(KLMAG2GEND-B031(FBGA153))
- H5TQ2G63BFR_MEM4G16D3EABG-125
- 3.0V - 1400mA
  3.0V - RTC - 30mA
  1.1V - CPU - 2000mA
  1.1V - GPU - 2000mA
  1.1V - CORE - 600mA
  1.5V - DDR3 - 2000mA
- 3.0V - 1400mA
  3.0V - RTC - 30mA
  1.1V - CPU - 2000mA
  1.1V - GPU - 2000mA
  1.1V - CORE - 600mA
  1.5V - DDR3 - 2000mA
- POWER UNITY
- MCU

## Library data of the parts
C1-C89 C91-C116 = rcl:C-EU: CAPACITOR, European symbol
CHGLED RUN = DOUBLE-SIDE:LED
IC1 = Renato_casa:MT29F8G08DAA: 4Gb, 8Gb, and 16Gb x8 NAND Flash Memory Source: http://download.micron.com/pdf/datasheets/flash/nand/4gb_nand_m40a.pdf
JP2 = SparkFun:JUMPER-2: Jumper Basic 0.1" spaced jumper. Use with breakaway headers.
JP4 JP5 = Renato_casa:JUMPER_2_NO
L15-L18 L20 = OLIMEX_DISCRET:L
P6 = gogo:TESTPAD: drill 40mils, diameter 70mils
Q1 = crystal:HC49/S: CRYSTAL
Q3 = crystal:Q_GND
R1-R23 R50 R51 R53 R58 R59 R65 R67 = rcl:R-EU_: RESISTOR, European symbol
SV1 SV3 = A20-OLINUXINO-MICRO_4GB_Rev_G1:CON-HARTING-ML_ML40: HARTING
SV2 = A20-OLINUXINO-MICRO_4GB_Rev_G1:CON-HARTING-ML_ML10: HARTING
SW1 = gogo:SW-TAKT
T4 = OLIMEX_DISCRET:WPM1481: WPM1481 According to DMP2035UVT.pdf datasheet by Nikolay -12V -6.5A P-CHANNEL Power MOSFET; Vds:-12V; Rds(on) max:0.023? @ Vgs=?4.5V; Descriptions: The WPM1481 is P-Channel enhancement MOS Field Effect Transistor. Uses advanced trench technology and design to provide excellent R DS (ON) with low gate charge. This device is suitable for use in DC-DC conversion, power switch and charging circuit. Standard Product WPM1481 is Pb-free and Halogen-free. Features: -Trench Technology -Supper high density cell design -Excellent ON resistance for higher DC -Extremely Low Threshold Voltage -Small package DFN2*2-6L
TP1-TP8 = Renato_casa:TEST-POINT
U1 = Renato_casa:ALLWINNER_A33: According to A33 Datasheet release1.0.pdf datasheet by Nikolay The Allwinner A33 is a remarkably power-efficient quad-core tablet processor based on ARM Cortex TM-A7 CPU along with Mali400MP2 GPU architecture. It is also highly competitive in terms of system cost thanks to its high system integration and is capable of delivering excellent user experience while maintaining ultra low power consumption. Main features: CPU architecture: A33 processor packs the most power efficient quad-core Cortex TM-A7 CPU architecture deliver outstanding system performance and impressive battery life experience; Graphic: A33 adopts the extensively implemented and technically mature Mali400MP2 GPU to provide end users with superior experience in web browsing, video playback and games, etc.; OpenGL ES 2.0 and OpenVG 1.1 standards are supported; Video Engine: A33 supports high-definition 1080P video processing and various mainstream video standards such as H.264, VP8, MPEG 1/2/4, JPEG/MJPEG, etc.; Display: A33 supports CPU/RGB/LVDS LCD interface up to 1280x800 resolution. Four-lane MIPI DSI (Display Serial Interface) is integrated as well, supporting MIPI DSI V1.01 and MIPI D-PHY V1.00; Image: A33 supports a parallel CMOS sensor interface up to 5M resolution
U2 = Renato_casa:MT41K256M16
U4 = Renato_casa:AXP221: PMIC Optimized For Multi-Core High-Performance System

## Net classes
1 pwr: width 0.406 mm, drill 0.203 mm

## Board
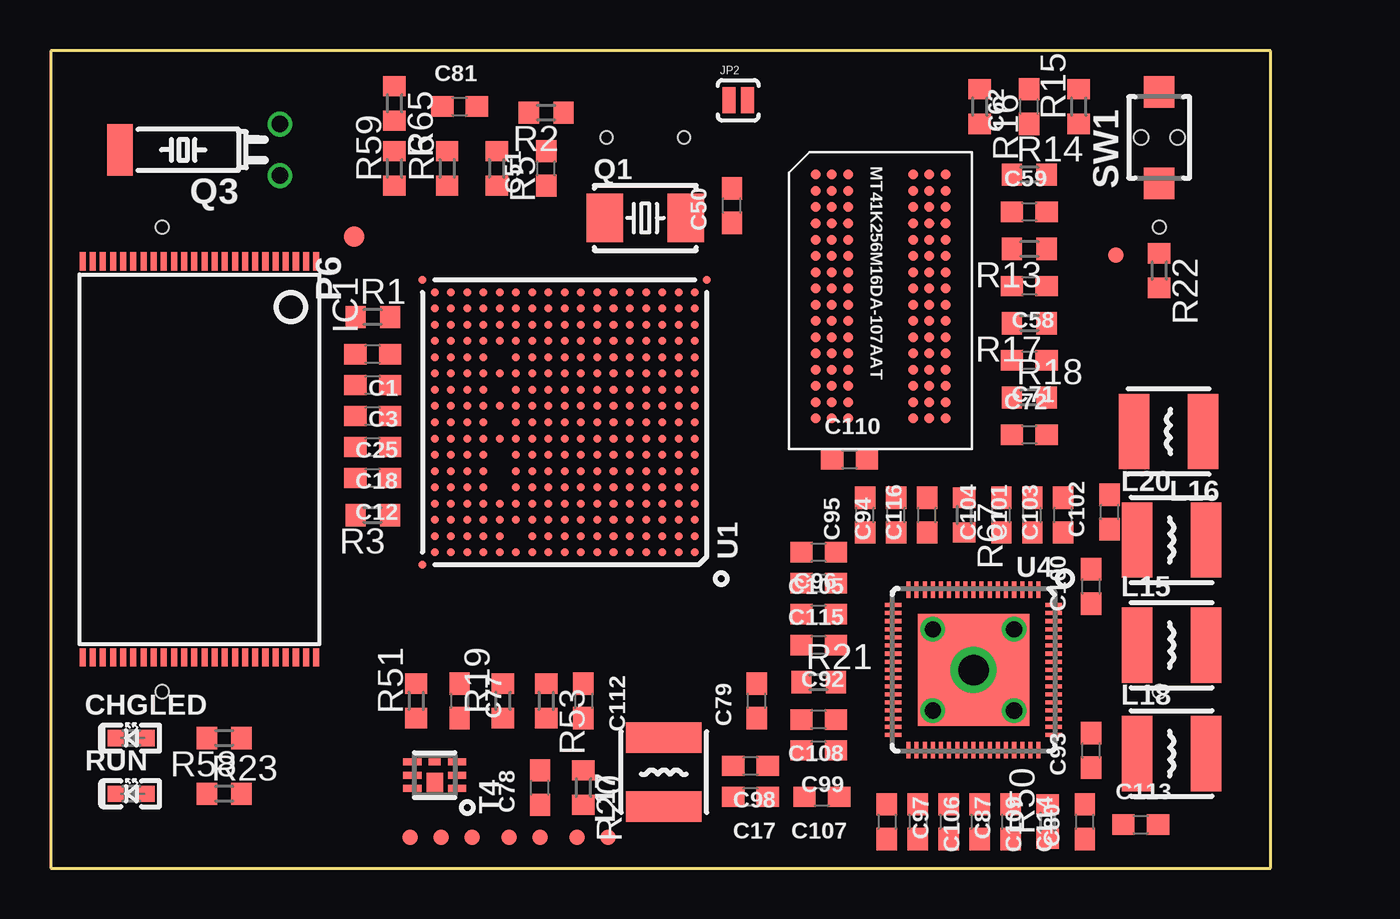
[diagram p5: board, top side]
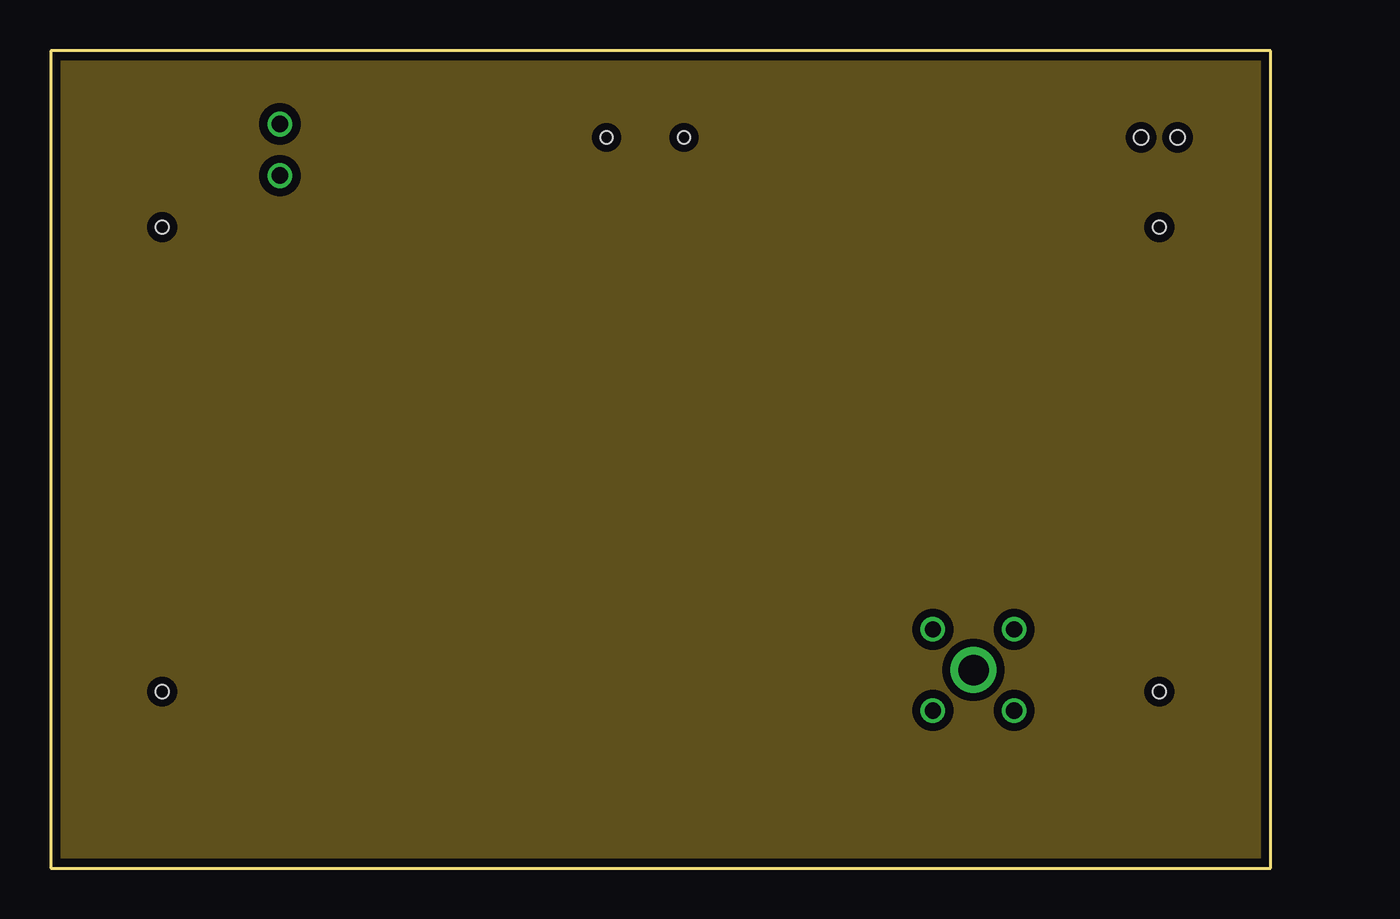
[diagram p6: board, inner layer Ground]
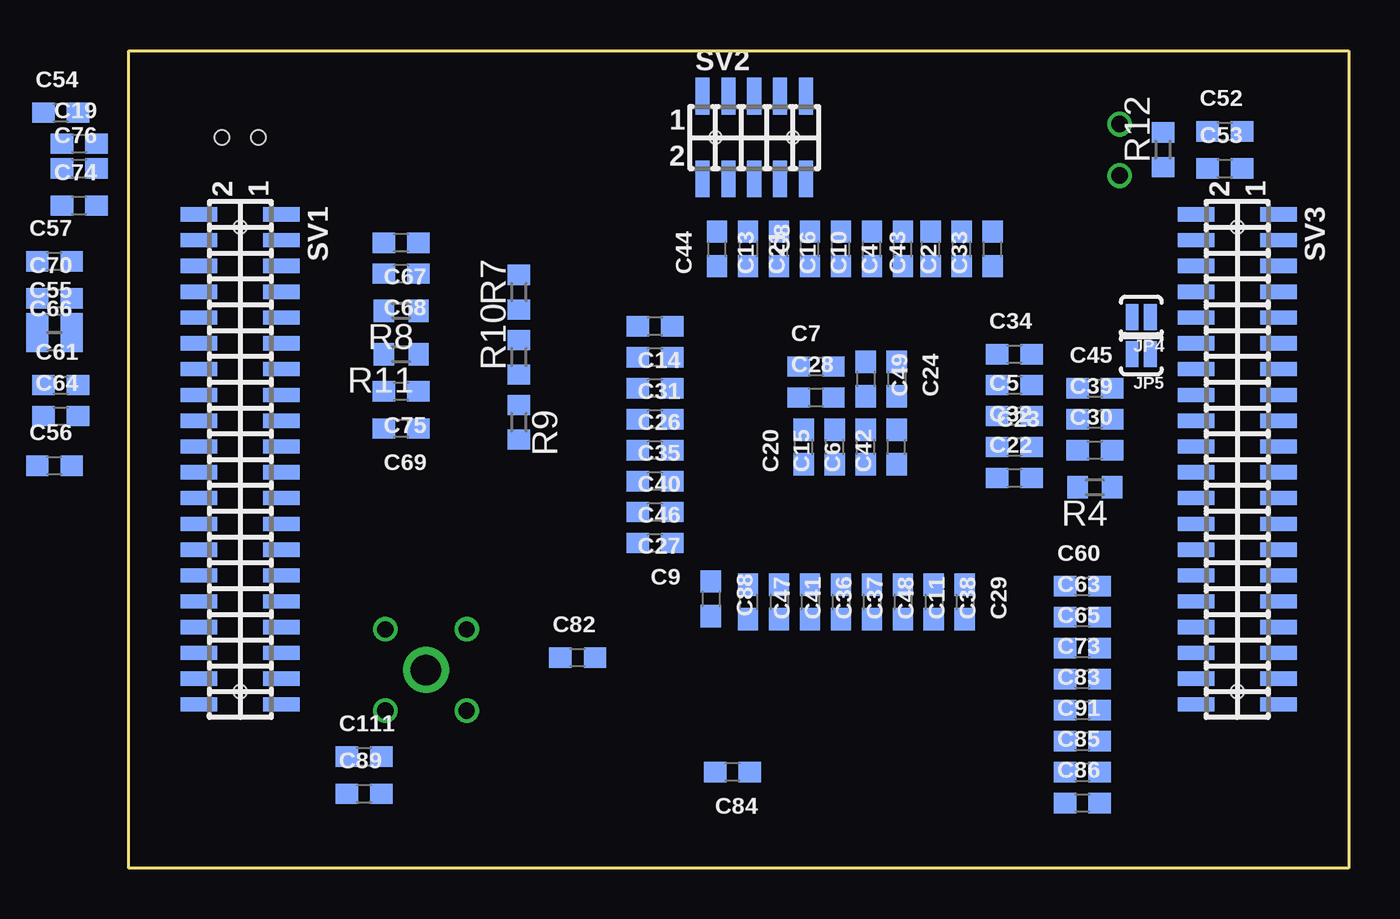
[diagram p7: board, bottom side, seen from below]

Size 60.05 x 40.23 mm. Coordinates in mm from the lower left corner, seen from the top.
Outline: 0,0 60.05,0 60.05,40.23 0,40.23 0,0
Copper layers (1+2*15+16): Top 0.035mm / dielectric 5mil / Route2 0.035mm / dielectric 0.5mm / Route15 0.035mm / dielectric 5mil / Bottom 0.035mm
Design rules "Renato_high *": minimum track width 4mil, minimum drill 0.2mm, track to track 5mil, track to pad 5mil, pad to pad 5mil, via to via 5mil, smd to smd 1mil, copper to edge 10mil, drill to drill 8mil, minimum pad ring 6mil, minimum via ring 2.5mil, stop-mask expansion 4mil, vias tented up to drill 28mil, thermal gap 20mil

### Footprints (pad centres in the part's own frame; a part is rotated, then mirrored left to right if it is on the bottom)
C0603 = smd 1.1 x 1: 1 -0.85,0; 2 0.85,0
LED-0603_TEST = smd 0.8 x 0.8: A 0.762,0; C -0.762,0
TSOP48 = smd 0.9 x 0.3: 1 -9.75,5.75; 2 -9.75,5.25; 3 -9.75,4.75; 4 -9.75,4.25; 5 -9.75,3.75; 6 -9.75,3.25; 7 -9.75,2.75; 8 -9.75,2.25; 9 -9.75,1.75; 10 -9.75,1.25; 11 -9.75,0.75; 12 -9.75,0.25; 13 -9.75,-0.25; 14 -9.75,-0.75; 15 -9.75,-1.25; 16 -9.75,-1.75; 17 -9.75,-2.25; 18 -9.75,-2.75; 19 -9.75,-3.25; 20 -9.75,-3.75; 21 -9.75,-4.25; 22 -9.75,-4.75; 23 -9.75,-5.25; 24 -9.75,-5.75; 25 9.75,-5.75; 26 9.75,-5.25; 27 9.75,-4.75; 28 9.75,-4.25; 29 9.75,-3.75; 30 9.75,-3.25; 31 9.75,-2.75; 32 9.75,-2.25; 33 9.75,-1.75; 34 9.75,-1.25; 35 9.75,-0.75; 36 9.75,-0.25; 37 9.75,0.25; 38 9.75,0.75; 39 9.75,1.25; 40 9.75,1.75; 41 9.75,2.25; 42 9.75,2.75; 43 9.75,3.25; 44 9.75,3.75; 45 9.75,4.25; 46 9.75,4.75; 47 9.75,5.25; 48 9.75,5.75
SJ_2S-NO = smd 0.635 x 1.27: 1 -0.45,0; 2 0.45,0
JUMPER_2_NO = smd 0.635 x 1.27: 1 -0.45,0; 2 0.45,0
SWPA4018S = smd 1.5 x 3.7: 1 -1.7,0; 2 1.7,0
TESTPAD_40-ROUND = smd 1.016 x 1.016: 1 0,0
HCX-4S = smd 1.8 x 2.4: 1 -2,0; 2 2,0
TC26H_3_REPAIR = drill 0.813: 1 -1.27,0; 2 1.27,0 | smd 2.54 x 1.27: GND 0,7.874
R0603 = smd 1 x 1.1: 1 -0.85,0; 2 0.85,0
CON-HARTING-ML_YA-V36P-2X20-LF_0.65_DRILL = smd 0.7 x 1.8: 1 -12.065,2.032; 2 -12.065,-2.032; 3 -10.795,2.032; 4 -10.795,-2.032; 5 -9.525,2.032; 6 -9.525,-2.032; 7 -8.255,2.032; 8 -8.255,-2.032; 9 -6.985,2.032; 10 -6.985,-2.032; 11 -5.715,2.032; 12 -5.715,-2.032; 13 -4.445,2.032; 14 -4.445,-2.032; 15 -3.175,2.032; 16 -3.175,-2.032; 17 -1.905,2.032; 18 -1.905,-2.032; 19 -0.635,2.032; 20 -0.635,-2.032; 21 0.635,2.032; 22 0.635,-2.032; 23 1.905,2.032; 24 1.905,-2.032; 25 3.175,2.032; 26 3.175,-2.032; 27 4.445,2.032; 28 4.445,-2.032; 29 5.715,2.032; 30 5.715,-2.032; 31 6.985,2.032; 32 6.985,-2.032; 33 8.255,2.032; 34 8.255,-2.032; 35 9.525,2.032; 36 9.525,-2.032; 37 10.795,2.032; 38 10.795,-2.032; 39 12.065,2.032; 40 12.065,-2.032 | hole 0.65: -11.43,0; 11.43,0
CON-HARTING-ML_YA-V36P-2X5-LF_0.60_DRILL = smd 0.7 x 1.8: 1 -2.54,2.032; 2 -2.54,-2.032; 3 -1.27,2.032; 4 -1.27,-2.032; 5 0,2.032; 6 0,-2.032; 7 1.27,2.032; 8 1.27,-2.032; 9 2.54,2.032; 10 2.54,-2.032 | hole 0.6: -1.905,0; 1.905,0
IT1185AU2 = smd 1.55 x 1.5: 1 -2.25,0; 2 2.25,0 | hole 0.7: 0,-0.9; 0,0.9
DFN2*2-6L = smd 0.35 x 0.9: 1 -0.65,-1.1; 2 0,-1.1; 3 0.65,-1.1; 4 0.65,1.1; 5 0,1.1; 6 -0.65,1.1 | smd 0.95 x 0.8: 7 -0.35,0 | smd 0.35 x 0.6: 8 0.65,0
PAD.03X.03 = smd 0.762 x 0.762: P$1 0,0
TFBGA282 = smd 0.4 x 0.4: A1 -6.4,-6.4; A2 -6.4,-5.6; A3 -6.4,-4.8; A4 -6.4,-4; A5 -6.4,-3.2; A6 -6.4,-2.4; A7 -6.4,-1.6; A8 -6.4,-0.8; A9 -6.4,0; A10 -6.4,0.8; A11 -6.4,1.6; A12 -6.4,2.4; A13 -6.4,3.2; A14 -6.4,4; A15 -6.4,4.8; A16 -6.4,5.6; A17 -6.4,6.4; B1 -5.6,-6.4; B2 -5.6,-5.6; B3 -5.6,-4.8; B4 -5.6,-4; B5 -5.6,-3.2; B6 -5.6,-2.4; B7 -5.6,-1.6; B8 -5.6,-0.8; B9 -5.6,0; B10 -5.6,0.8; B11 -5.6,1.6; B13 -5.6,3.2; B14 -5.6,4; B15 -5.6,4.8; B16 -5.6,5.6; B17 -5.6,6.4; C1 -4.8,-6.4; C2 -4.8,-5.6; C3 -4.8,-4.8; C4 -4.8,-4; C5 -4.8,-3.2; C6 -4.8,-2.4; C7 -4.8,-1.6; C8 -4.8,-0.8; C9 -4.8,0; C10 -4.8,0.8; C11 -4.8,1.6; C12 -4.8,2.4; C13 -4.8,3.2; C14 -4.8,4; C15 -4.8,4.8; C16 -4.8,5.6; C17 -4.8,6.4; D1 -4,-6.4; D2 -4,-5.6; D3 -4,-4.8; D4 -4,-4; D5 -4,-3.2; D6 -4,-2.4; D7 -4,-1.6; D8 -4,-0.8; D9 -4,0; D10 -4,0.8; D11 -4,1.6; D12 -4,2.4; D13 -4,3.2; D14 -4,4; D15 -4,4.8; D16 -4,5.6; D17 -4,6.4; E1 -3.2,-6.4; E2 -3.2,-5.6; E3 -3.2,-4.8; E4 -3.2,-4; E5 -3.2,-3.2; E6 -3.2,-2.4; E7 -3.2,-1.6; E8 -3.2,-0.8; E9 -3.2,0; E10 -3.2,0.8; E11 -3.2,1.6; E12 -3.2,2.4; E14 -3.2,4; E15 -3.2,4.8; E16 -3.2,5.6; E17 -3.2,6.4; F1 -2.4,-6.4; F2 -2.4,-5.6; F3 -2.4,-4.8; F4 -2.4,-4; F5 -2.4,-3.2; F6 -2.4,-2.4; F7 -2.4,-1.6; F8 -2.4,-0.8; F9 -2.4,0; F10 -2.4,0.8; F11 -2.4,1.6; F12 -2.4,2.4; F14 -2.4,4; F15 -2.4,4.8; F16 -2.4,5.6; F17 -2.4,6.4; FID1 7,-7; FID2 7,7; FID3 -7,7; G1 -1.6,-6.4; G2 -1.6,-5.6; G3 -1.6,-4.8; G4 -1.6,-4; G5 -1.6,-3.2; G6 -1.6,-2.4; G7 -1.6,-1.6; G8 -1.6,-0.8; G9 -1.6,0; G10 -1.6,0.8; G11 -1.6,1.6; G12 -1.6,2.4; G14 -1.6,4; G15 -1.6,4.8; G16 -1.6,5.6; G17 -1.6,6.4; H1 -0.8,-6.4; H2 -0.8,-5.6; H3 -0.8,-4.8; H4 -0.8,-4; H5 -0.8,-3.2; H6 -0.8,-2.4; H7 -0.8,-1.6; H8 -0.8,-0.8; H9 -0.8,0; H10 -0.8,0.8; H11 -0.8,1.6; H12 -0.8,2.4; H13 -0.8,3.2; H14 -0.8,4; H15 -0.8,4.8; H16 -0.8,5.6; H17 -0.8,6.4; J1 0,-6.4; J2 0,-5.6; J3 0,-4.8; J4 0,-4; J5 0,-3.2; J6 0,-2.4; J7 0,-1.6; J8 0,-0.8; J9 0,0; J10 0,0.8; J11 0,1.6; J12 0,2.4; J14 0,4; J15 0,4.8; J16 0,5.6; J17 0,6.4; K1 0.8,-6.4; K2 0.8,-5.6; K3 0.8,-4.8; K4 0.8,-4; K5 0.8,-3.2; K6 0.8,-2.4; K7 0.8,-1.6; K8 0.8,-0.8; K9 0.8,0; K10 0.8,0.8; K11 0.8,1.6; K12 0.8,2.4; K13 0.8,3.2; K14 0.8,4; K15 0.8,4.8; K16 0.8,5.6; K17 0.8,6.4; L1 1.6,-6.4; L2 1.6,-5.6; L3 1.6,-4.8; L4 1.6,-4; L5 1.6,-3.2; L6 1.6,-2.4; L7 1.6,-1.6; L8 1.6,-0.8; L9 1.6,0; L10 1.6,0.8; L11 1.6,1.6; L12 1.6,2.4; L14 1.6,4; L15 1.6,4.8; L16 1.6,5.6; L17 1.6,6.4; M1 2.4,-6.4; M2 2.4,-5.6; M3 2.4,-4.8; M4 2.4,-4; M5 2.4,-3.2; M6 2.4,-2.4; M7 2.4,-1.6; M8 2.4,-0.8; M9 2.4,0; M10 2.4,0.8; M11 2.4,1.6; M12 2.4,2.4; M13 2.4,3.2; M14 2.4,4; M15 2.4,4.8; M16 2.4,5.6; M17 2.4,6.4; N1 3.2,-6.4; N2 3.2,-5.6; N3 3.2,-4.8; N4 3.2,-4; N5 3.2,-3.2; N6 3.2,-2.4; N7 3.2,-1.6; N8 3.2,-0.8; N9 3.2,0; N10 3.2,0.8; N11 3.2,1.6; N12 3.2,2.4; N14 3.2,4; N15 3.2,4.8; N16 3.2,5.6; N17 3.2,6.4; P1 4,-6.4; P2 4,-5.6; P3 4,-4.8; P4 4,-4; P5 4,-3.2; P6 4,-2.4; P7 4,-1.6; P8 4,-0.8; P9 4,0; P10 4,0.8; P11 4,1.6; P12 4,2.4; P13 4,3.2; P14 4,4; P15 4,4.8; P16 4,5.6; P17 4,6.4; R1 4.8,-6.4; R2 4.8,-5.6; R3 4.8,-4.8; R4 4.8,-4; R5 4.8,-3.2; R6 4.8,-2.4; R7 4.8,-1.6; R8 4.8,-0.8; R9 4.8,0; R10 4.8,0.8; R11 4.8,1.6; R12 4.8,2.4; R13 4.8,3.2; R14 4.8,4; R15 4.8,4.8; R16 4.8,5.6; R17 4.8,6.4; T1 5.6,-6.4; T2 5.6,-5.6; T3 5.6,-4.8; T4 5.6,-4; T5 5.6,-3.2; T6 5.6,-2.4; T7 5.6,-1.6; T8 5.6,-0.8; T9 5.6,0; T10 5.6,0.8; T11 5.6,1.6; T12 5.6,2.4; T13 5.6,3.2; T14 5.6,4; T15 5.6,4.8; T16 5.6,5.6; T17 5.6,6.4; U1 6.4,-6.4; U2 6.4,-5.6; U3 6.4,-4.8; U4 6.4,-4; U5 6.4,-3.2; U6 6.4,-2.4; U7 6.4,-1.6; U8 6.4,-0.8; U9 6.4,0; U10 6.4,0.8; U11 6.4,1.6; U12 6.4,2.4; U13 6.4,3.2; U14 6.4,4; U15 6.4,4.8; U16 6.4,5.6; U17 6.4,6.4
FBGA_96BALL = smd 0.5 x 0.5: A1 -3.2,6.4; A2 -2.4,6.4; A3 -1.6,6.4; A7 1.6,6.4; A8 2.4,6.4; A9 3.2,6.4; B1 -3.2,5.6; B2 -2.4,5.6; B3 -1.6,5.6; B7 1.6,5.6; B8 2.4,5.6; B9 3.2,5.6; C1 -3.2,4.8; C2 -2.4,4.8; C3 -1.6,4.8; C7 1.6,4.8; C8 2.4,4.8; C9 3.2,4.8; D1 -3.2,4; D2 -2.4,4; D3 -1.6,4; D7 1.6,4; D8 2.4,4; D9 3.2,4; E1 -3.2,3.2; E2 -2.4,3.2; E3 -1.6,3.2; E7 1.6,3.2; E8 2.4,3.2; E9 3.2,3.2; F1 -3.2,2.4; F2 -2.4,2.4; F3 -1.6,2.4; F7 1.6,2.4; F8 2.4,2.4; F9 3.2,2.4; G1 -3.2,1.6; G2 -2.4,1.6; G3 -1.6,1.6; G7 1.6,1.6; G8 2.4,1.6; G9 3.2,1.6; H1 -3.2,0.8; H2 -2.4,0.8; H3 -1.6,0.8; H7 1.6,0.8; H8 2.4,0.8; H9 3.2,0.8; J1 -3.2,0; J2 -2.4,0; J3 -1.6,0; J7 1.6,0; J8 2.4,0; J9 3.2,0; K1 -3.2,-0.8; K2 -2.4,-0.8; K3 -1.6,-0.8; K7 1.6,-0.8; K8 2.4,-0.8; K9 3.2,-0.8; L1 -3.2,-1.6; L2 -2.4,-1.6; L3 -1.6,-1.6; L7 1.6,-1.6; L8 2.4,-1.6; L9 3.2,-1.6; M1 -3.2,-2.4; M2 -2.4,-2.4; M3 -1.6,-2.4; M7 1.6,-2.4; M8 2.4,-2.4; M9 3.2,-2.4; N1 -3.2,-3.2; N2 -2.4,-3.2; N3 -1.6,-3.2; N7 1.6,-3.2; N8 2.4,-3.2; N9 3.2,-3.2; P1 -3.2,-4; P2 -2.4,-4; P3 -1.6,-4; P7 1.6,-4; P8 2.4,-4; P9 3.2,-4; R1 -3.2,-4.8; R2 -2.4,-4.8; R3 -1.6,-4.8; R7 1.6,-4.8; R8 2.4,-4.8; R9 3.2,-4.8; T1 -3.2,-5.6; T2 -2.4,-5.6; T3 -1.6,-5.6; T7 1.6,-5.6; T8 2.4,-5.6; T9 3.2,-5.6
OLIMEX_IC_QFN68-8X8-04 = smd 0.2 x 0.8: 1 -3.2,-3.95; 2 -2.8,-3.95; 3 -2.4,-3.95; 4 -2,-3.95; 5 -1.6,-3.95; 6 -1.2,-3.95; 7 -0.8,-3.95; 8 -0.4,-3.95; 9 0,-3.95; 10 0.4,-3.95; 11 0.8,-3.95; 12 1.2,-3.95; 13 1.6,-3.95; 14 2,-3.95; 15 2.4,-3.95; 16 2.8,-3.95; 17 3.2,-3.95; 35 3.2,3.95; 36 2.8,3.95; 37 2.4,3.95; 38 2,3.95; 39 1.6,3.95; 40 1.2,3.95; 41 0.8,3.95; 42 0.4,3.95; 43 0,3.95; 44 -0.4,3.95; 45 -0.8,3.95; 46 -1.2,3.95; 47 -1.6,3.95; 48 -2,3.95; 49 -2.4,3.95; 50 -2.8,3.95; 51 -3.2,3.95 | smd 0.8 x 0.2: 18 3.95,-3.2; 19 3.95,-2.8; 20 3.95,-2.4; 21 3.95,-2; 22 3.95,-1.6; 23 3.95,-1.2; 24 3.95,-0.8; 25 3.95,-0.4; 26 3.95,0; 27 3.95,0.4; 28 3.95,0.8; 29 3.95,1.2; 30 3.95,1.6; 31 3.95,2; 32 3.95,2.4; 33 3.95,2.8; 34 3.95,3.2; 52 -3.95,3.2; 53 -3.95,2.8; 54 -3.95,2.4; 55 -3.95,2; 56 -3.95,1.6; 57 -3.95,1.2; 58 -3.95,0.8; 59 -3.95,0.4; 60 -3.95,0; 61 -3.95,-0.4; 62 -3.95,-0.8; 63 -3.95,-1.2; 64 -3.95,-1.6; 65 -3.95,-2; 66 -3.95,-2.4; 67 -3.95,-2.8; 68 -3.95,-3.2 | smd 5.49 x 5.49: GND 0,0 | drill 1.5: GND1 0,0 | drill 0.8: GND2 -2,-2; GND3 -2,2; GND4 2,2; GND5 2,-2

### Placement (x,y rotation side)
C1  15.85,25.3 180 top
C2  19.05,30.48 90 bottom
C3  15.85,23.77 180 top
C4  21.95,30.48 90 bottom
C5  16.46,22.25 0 bottom
C6  23.77,20.73 90 bottom
C7  26.21,24.69 0 bottom
C8  29.57,30.48 270 bottom
C9  34.14,16 180 bottom
C10  23.47,30.48 90 bottom
C11  21.95,13.11 270 bottom
C12  15.85,19.2 180 top
C13  28.04,30.48 90 bottom
C14  34.14,26.67 180 bottom
C15  25.3,20.73 90 bottom
C16  24.99,30.48 90 bottom
C17  34.44,3.51 180 top
C18  15.85,20.73 180 top
C19  62.48,35.66 0 bottom
C20  26.82,20.73 90 bottom
C21  26.52,30.48 90 bottom
C22  16.46,19.2 0 bottom
C23  16.46,23.77 180 bottom
C24  22.25,24.08 270 bottom
C25  15.85,22.25 180 top
C26  34.14,23.62 180 bottom
C27  34.14,17.53 180 bottom
C28  26.21,23.16 0 bottom
C29  18.9,13.11 270 bottom
C30  12.5,20.57 0 bottom
C31  34.14,25.15 180 bottom
C32  16.46,20.73 0 bottom
C33  17.53,30.48 90 bottom
C34  16.46,25.3 0 bottom
C35  34.14,22.1 180 bottom
C36  26.52,13.11 270 bottom
C37  24.99,13.11 270 bottom
C38  20.42,13.11 270 bottom
C39  12.5,22.1 0 bottom
C40  34.14,20.57 180 bottom
C41  28.04,13.11 270 bottom
C42  22.25,20.73 90 bottom
C43  20.57,30.48 90 bottom
C44  31.09,30.48 90 bottom
C45  12.5,23.62 0 bottom
C46  34.14,19.05 180 bottom
C47  29.57,13.11 270 bottom
C48  23.47,13.11 270 bottom
C49  23.77,24.08 270 bottom
C50  33.53,32.61 90 top
C51  24.38,34.44 90 top
C52  6.1,36.27 0 bottom
C53  6.1,34.44 0 bottom
C54  63.4,37.19 0 bottom
C55  63.7,26.82 0 bottom
C56  63.7,19.81 0 bottom
C57  63.7,29.87 0 bottom
C58  48.16,28.65 180 top
C59  48.16,32.31 0 top
C60  13.11,13.87 0 bottom
C61  63.4,23.77 0 bottom
C62  48.16,37.49 90 top
C63  13.11,12.34 0 bottom
C64  63.4,22.25 0 bottom
C65  13.11,10.82 0 bottom
C66  63.7,25.91 0 bottom
C67  46.63,30.78 180 bottom
C68  46.63,29.26 180 bottom
C69  46.63,21.64 180 bottom
C70  63.7,28.04 0 bottom
C71  48.16,24.99 180 top
C72  48.16,21.34 0 top
C73  13.11,9.3 0 bottom
C74  62.48,32.61 0 bottom
C75  46.63,23.47 180 bottom
C76  62.48,34.44 0 bottom
C77  20.12,8.23 270 top
C78  24.08,3.96 90 top
C79  34.75,8.23 90 top
C80  50.9,2.29 90 top
C81  20.12,37.49 0 top
C82  37.95,10.36 0 bottom
C83  13.11,7.77 0 bottom
C84  30.33,4.72 180 bottom
C85  13.11,4.72 0 bottom
C86  13.11,3.2 0 bottom
C87  44.2,2.29 270 top
C88  31.39,13.26 270 bottom
C89  48.46,3.66 0 bottom
C91  13.11,6.25 0 bottom
C92  37.8,10.97 180 top
C93  51.21,5.79 90 top
C94  41.61,17.37 90 top
C95  40.08,17.37 90 top
C96  37.8,12.5 0 top
C97  41.15,2.29 270 top
C98  34.44,5.03 180 top
C99  37.8,5.79 180 top
C100  51.21,13.87 90 top
C101  48.31,17.37 90 top
C102  52.12,17.53 90 top
C103  49.83,17.37 90 top
C104  46.79,17.37 90 top
C105  37.8,15.54 180 top
C106  42.67,2.29 270 top
C107  37.95,3.51 180 top
C108  37.8,7.32 180 top
C109  45.72,2.29 270 top
C110  39.32,20.12 0 top
C111  48.46,5.49 0 bottom
C112  26.21,8.23 270 top
C113  53.64,2.13 0 top
C114  47.24,2.29 270 top
C115  37.8,14.02 180 top
C116  43.13,17.37 90 top
CHGLED  3.96,6.4 0 top
IC1  7.32,20.12 270 top
JP2  33.83,37.8 0 top
JP4  10.21,27.13 180 bottom
JP5  10.21,25.3 180 bottom
L15  55.17,10.97 0 top
L16  55.02,21.49 180 top
L17  30.18,4.72 90 top
L18  55.17,5.64 0 top
L20  55.17,16.15 0 top
P6  14.94,31.09 90 top
Q1  29.26,32 0 top
Q3  11.28,35.36 90 top
R1  15.85,27.13 0 top
R2  24.38,37.19 180 top
R3  15.85,17.37 180 top
R4  12.5,18.75 180 bottom
R5  21.95,34.44 270 top
R6  19.51,34.44 90 top
R7  40.84,28.35 90 bottom
R8  46.63,27.43 180 bottom
R9  40.84,21.95 270 bottom
R10  40.84,25.15 90 bottom
R11  46.63,25.3 180 bottom
R12  9.14,35.36 90 bottom
R13  48.16,30.48 180 top
R14  48.16,34.14 0 top
R15  50.6,37.49 90 top
R16  45.72,37.49 270 top
R17  48.16,26.82 180 top
R18  48.16,23.16 0 top
R19  22.25,8.23 90 top
R20  26.21,3.96 270 top
R21  37.8,9.14 0 top
R22  54.56,29.41 270 top
R23  8.53,3.66 0 top
R50  49.07,2.29 90 top
R51  17.98,8.23 90 top
R53  24.38,8.23 270 top
R58  8.53,6.4 180 top
R59  16.92,34.44 90 top
R65  16.92,37.64 270 top
R67  44.96,17.37 270 top
RUN  3.96,3.66 0 top
SV1  54.56,20.12 270 bottom
SV2  29.26,35.97 0 bottom
SV3  5.49,20.12 270 bottom
SW1  54.56,35.97 90 top
T4  18.9,4.57 90 top
TP1  27.43,1.52 0 top
TP2  25.91,1.52 0 top
TP3  22.56,1.52 0 top
TP4  52.43,30.18 0 top
TP5  19.2,1.52 0 top
TP6  20.73,1.52 0 top
TP7  17.68,1.52 0 top
TP8  24.08,1.52 0 top
U1  25.3,21.95 90 top
U2  40.84,27.74 0 top
U4  45.42,9.75 180 top

### Tracks (layer width: path | path; a pad name or v marks a point on that pad's centre or on a via)
GND
  pour Ground (isolate 0.406): 0,40.23 60.05,40.23 60.05,0 0,0